# Altium project DEVEFX000001A.PrjPcb (part 1 of 2)
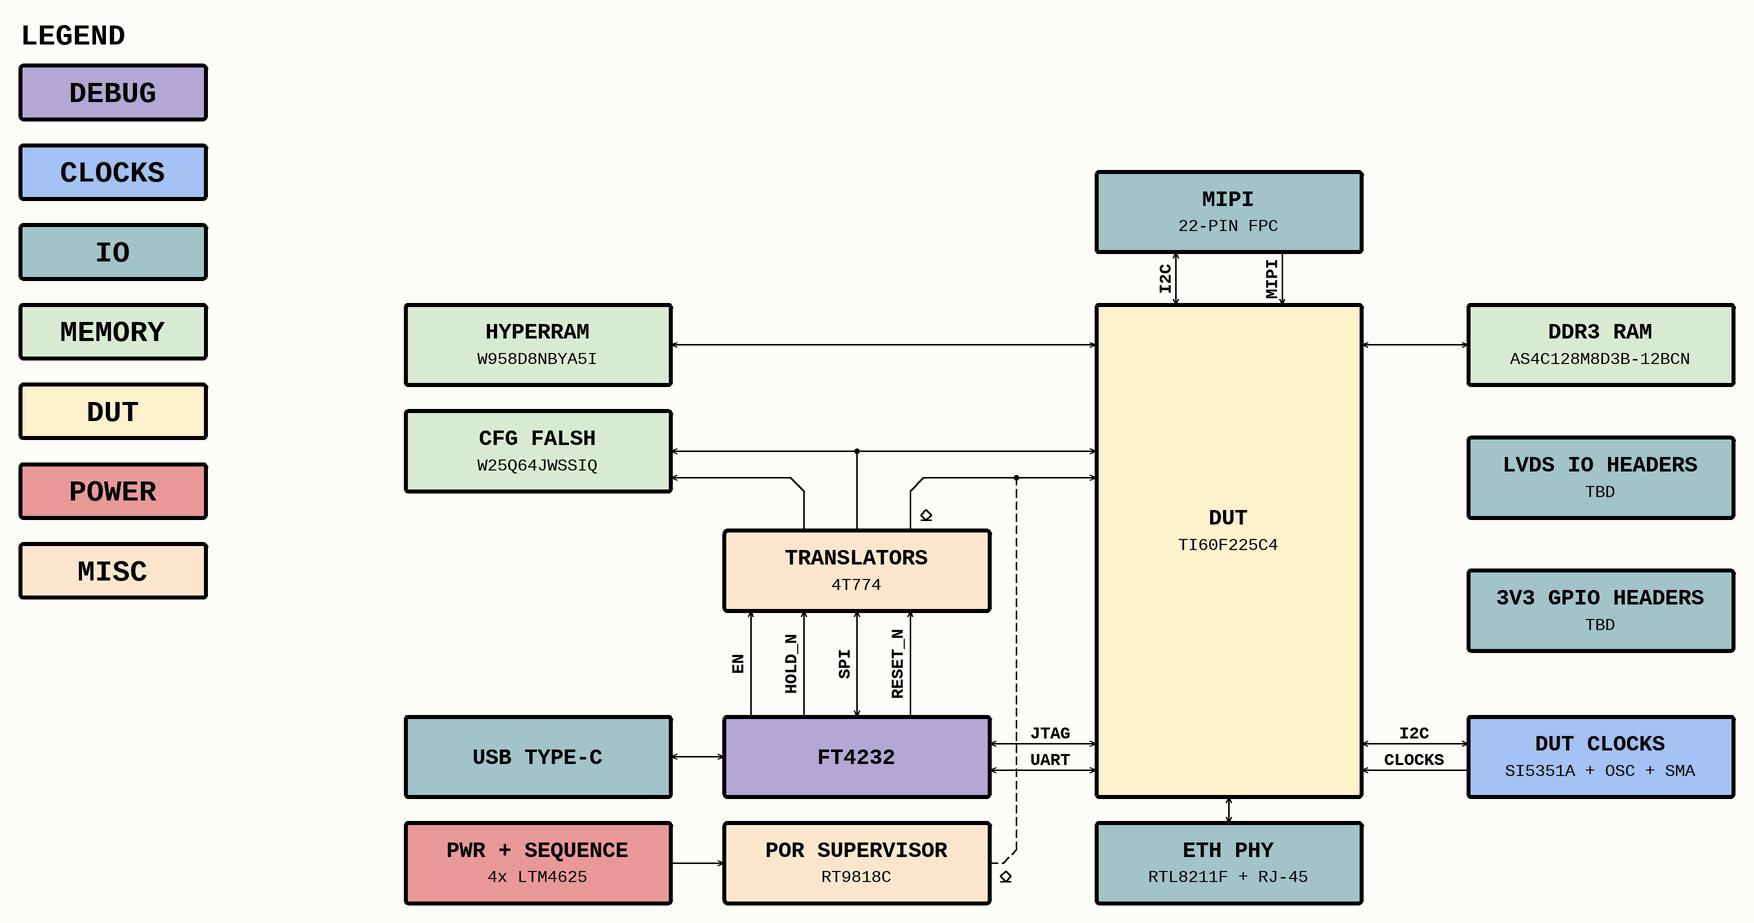
[diagram p0: 01_TOP.SchDoc]
21 sheets, 288 parts. Net scope: flat (ports and power ports of the same name join across sheets).
Board file: DEVEFX000001A.PcbDoc
Sheets:
  01_TOP.SchDoc
  02_RSVD.SchDoc
  03_RSVD.SchDoc
  04_RSVD.SchDoc
  05_FPGA_HVIO.SchDoc
  06_FPGA_HSIO_B1.SchDoc
  07_FPGA_HSIO_B2.SchDoc
  08_FPGA_HSIO_B3.SchDoc
  09_FPGA_HSIO_B4.SchDoc
  10_FPGA_PWR.SchDoc
  11_MEM_HYPERRAM_FLASH.SchDoc
  12_MEM_DDR3.SchDoc
  13_IO_ETH.SchDoc
  14_IO_MIPI.SchDoc
  15_IO_USB.SchDoc
  16_IO_LVDS.SchDoc
  17_IO_HEADERS.SchDoc
  18_PWR_INPUT.SchDoc
  19_PWR_VRS.SchDoc
  20_CLOCKS.SchDoc
  21_RESET_MISC.SchDoc

## Sheet 01_TOP.SchDoc
size A3; DocumentNumber: 1; SheetNumber: 1; SheetTotal: 21

### Notes on the sheet
- LEGEND
- DEBUG
- CLOCKS
- MIPI
- 22-PIN FPC
- IO
- I2C
- MEMORY
- HYPERRAM
- W958D8NBYA5I
- DDR3 RAM
- AS4C128M8D3B-12BCN
- DUT
- CFG FALSH
- POWER
- W25Q64JWSSIQ
- LVDS IO HEADERS
- TBD
- MISC
- TRANSLATORS
- TI60F225C4
- 4T774
- 3V3 GPIO HEADERS
- EN
- HOLD_N
- SPI
- RESET_N
- USB TYPE-C
- FT4232
- JTAG
- UART
- DUT CLOCKS
- SI5351A + OSC + SMA
- PWR + SEQUENCE
- 4x LTM4625
- POR SUPERVISOR
- RT9818C
- ETH PHY
- RTL8211F + RJ-45

## Sheet 02_RSVD.SchDoc
size A3; DocumentNumber: 2; SheetNumber: 2; SheetTotal: 21
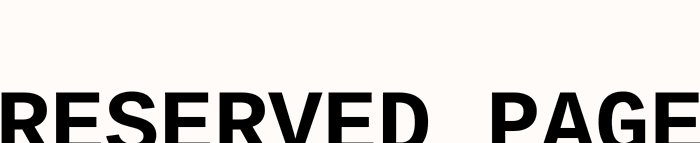
[diagram p1: 02_RSVD.SchDoc]

### Notes on the sheet
- RESERVED PAGE

## Sheet 03_RSVD.SchDoc
size A3; DocumentNumber: 3; SheetNumber: 3; SheetTotal: 21
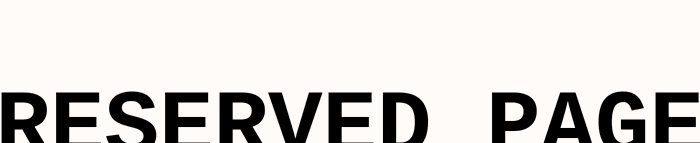
[diagram p2: 03_RSVD.SchDoc]

### Notes on the sheet
- RESERVED PAGE

## Sheet 04_RSVD.SchDoc
size A3; DocumentNumber: 4; SheetNumber: 4; SheetTotal: 21
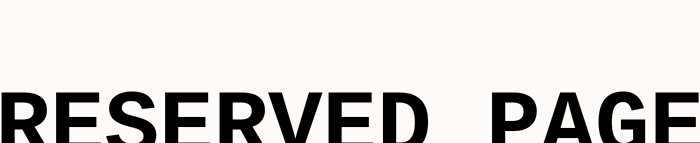
[diagram p3: 04_RSVD.SchDoc]

### Notes on the sheet
- RESERVED PAGE

## Sheet 05_FPGA_HVIO.SchDoc
size A3; DocumentNumber: 5; SheetNumber: 5; SheetTotal: 21
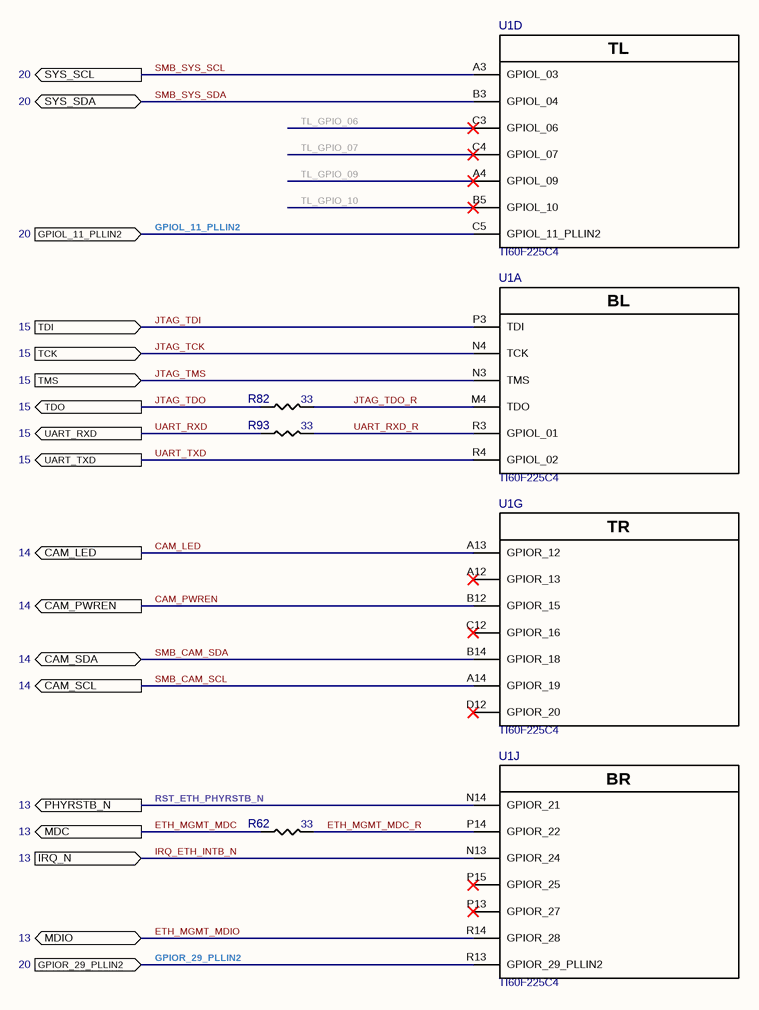
[diagram p4: 05_FPGA_HVIO.SchDoc]

### Parts
R62  33  [RESC1005X03N]
R82  33  [RESC1005X03N]
R93  33  [RESC1005X03N]
U1  TI60F225C4  [BGA225C65P15X15_1000X1000X100]  (parts A,D,G,J of 13)

### Ports
CAM_LED (out, see 14), CAM_PWREN (out, see 14), CAM_SCL (out, see 14), CAM_SDA (bidir, see 14), GPIOL_11_PLLIN2 (in, see 20), GPIOR_29_PLLIN2 (in, see 20), IRQ_N (in, see 13), MDC (out, see 13), MDIO (bidir, see 13), PHYRSTB_N (out, see 13), SYS_SCL (out, see 20), SYS_SDA (bidir, see 20), TCK (in, see 15), TDI (in, see 15), TDO (out, see 15), TMS (in, see 15), UART_RXD (out, see 15), UART_TXD (out, see 15)

### Nets
CAM_LED: U1.A13(GPIOR_12) ; port CAM_LED
CAM_PWREN: U1.B12(GPIOR_15) ; port CAM_PWREN
ETH_MGMT_MDC: R62.1 ; port MDC
ETH_MGMT_MDC_R: R62.2 U1.P14(GPIOR_22)
ETH_MGMT_MDIO: U1.R14(GPIOR_28) ; port MDIO
GPIOL_11_PLLIN2: U1.C5(GPIOL_11_PLLIN2) ; port GPIOL_11_PLLIN2
GPIOR_29_PLLIN2: U1.R13(GPIOR_29_PLLIN2) ; port GPIOR_29_PLLIN2
IRQ_ETH_INTB_N: U1.N13(GPIOR_24) ; port IRQ_N
JTAG_TCK: U1.N4(TCK) ; port TCK
JTAG_TDI: U1.P3(TDI) ; port TDI
JTAG_TDO: R82.1 ; port TDO
JTAG_TDO_R: R82.2 U1.M4(TDO)
JTAG_TMS: U1.N3(TMS) ; port TMS
RST_ETH_PHYRSTB_N: U1.N14(GPIOR_21) ; port PHYRSTB_N
SMB_CAM_SCL: U1.A14(GPIOR_19) ; port CAM_SCL
SMB_CAM_SDA: U1.B14(GPIOR_18) ; port CAM_SDA
SMB_SYS_SCL: U1.A3(GPIOL_03) ; port SYS_SCL
SMB_SYS_SDA: U1.B3(GPIOL_04) ; port SYS_SDA
TL_GPIO_06: U1.C3(GPIOL_06)
TL_GPIO_07: U1.C4(GPIOL_07)
TL_GPIO_09: U1.A4(GPIOL_09)
TL_GPIO_10: U1.B5(GPIOL_10)
UART_RXD: R93.1 ; port UART_RXD
UART_RXD_R: R93.2 U1.R3(GPIOL_01)
UART_TXD: U1.R4(GPIOL_02) ; port UART_TXD

Not connected (* = marked no-connect by the designer): U1 A12(GPIOR_13)* C12(GPIOR_16)* D12(GPIOR_20)* P13(GPIOR_27)* P15(GPIOR_25)*

### Notes on the sheet
- (in symbol TI60F225C4, part A) BL
- (in symbol TI60F225C4, part D) TL
- (in symbol TI60F225C4, part G) TR
- (in symbol TI60F225C4, part J) BR

### Library data of the parts
R62 R82 R93 = RC0402FR-0733RL: RES SMD 33 OHM 1% 1/16W 0402; Manufacturer 1: Yageo; Part Number: RC0402FR-0733RL; Value: 33; Tol: 1%; Manufacturer Part Number 1: RC0402FR-0733RL; Supplier 1: Digi-Key; Supplier Part Number 1: 311-33.0LRCT-ND
U1 = TI60F225C4: FPGA TITAN 140HSIO 4PLL 225BGA; Manufacturer 1: Efinix, Inc.; Part Number: TI60F225C4; Manufacturer Part Number 1: TI60F225C4; Supplier 1: Digi-Key; Supplier Part Number 1: 2134-TI60F225C4-ND

## Sheet 06_FPGA_HSIO_B1.SchDoc
size A3; DocumentNumber: 6; SheetNumber: 6; SheetTotal: 21
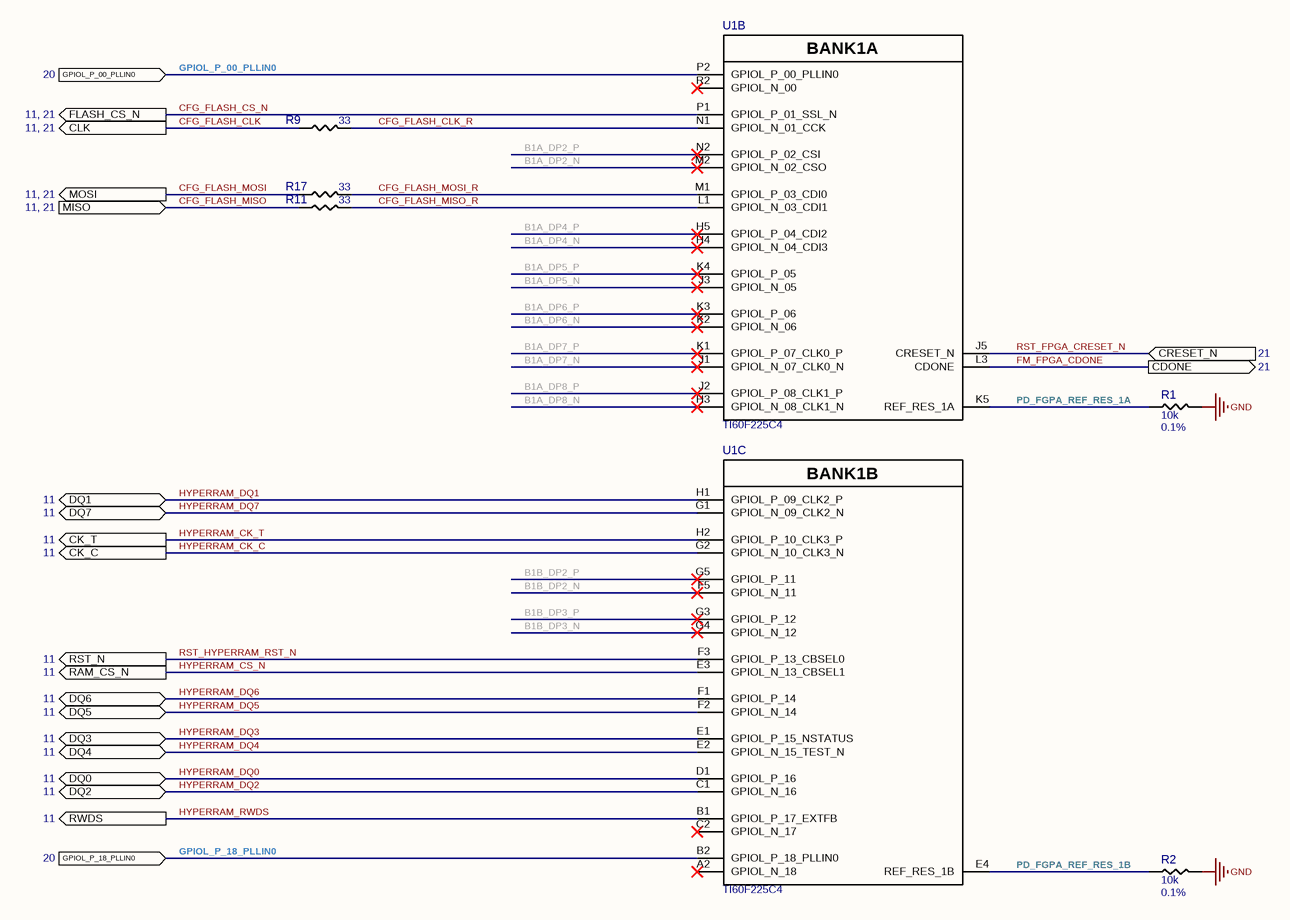
[diagram p5: 06_FPGA_HSIO_B1.SchDoc]

### Parts
R1  10k  Tol: 0.1%  [RESC1005X03N]
R2  10k  Tol: 0.1%  [RESC1005X03N]
R9  33  [RESC1005X03N]
R11  33  [RESC1005X03N]
R17  33  [RESC1005X03N]
U1  TI60F225C4  [BGA225C65P15X15_1000X1000X100]  (parts B,C of 13)

### Ports
CDONE (out, see 21), CK_C (out, see 11), CK_T (out, see 11), CLK (out, see 11, 21), CRESET_N (in, see 21), DQ0 (bidir, see 11), DQ1 (bidir, see 11), DQ2 (bidir, see 11), DQ3 (bidir, see 11), DQ4 (bidir, see 11), DQ5 (bidir, see 11), DQ6 (bidir, see 11), DQ7 (bidir, see 11), FLASH_CS_N (out, see 11, 21), GPIOL_P_00_PLLIN0 (in, see 20), GPIOL_P_18_PLLIN0 (in, see 20), MISO (in, see 11, 21), MOSI (out, see 11, 21), RAM_CS_N (out, see 11), RST_N (out, see 11), RWDS (out, see 11)

### Nets
GND: R1.2 R2.2
B1A_DP2_N: U1.M2(GPIOL_N_02_CSO)
B1A_DP2_P: U1.N2(GPIOL_P_02_CSI)
B1A_DP4_N: U1.H4(GPIOL_N_04_CDI3)
B1A_DP4_P: U1.H5(GPIOL_P_04_CDI2)
B1A_DP5_N: U1.J3(GPIOL_N_05)
B1A_DP5_P: U1.K4(GPIOL_P_05)
B1A_DP6_N: U1.K2(GPIOL_N_06)
B1A_DP6_P: U1.K3(GPIOL_P_06)
B1A_DP7_N: U1.J1(GPIOL_N_07_CLK0_N)
B1A_DP7_P: U1.K1(GPIOL_P_07_CLK0_P)
B1A_DP8_N: U1.H3(GPIOL_N_08_CLK1_N)
B1A_DP8_P: U1.J2(GPIOL_P_08_CLK1_P)
B1B_DP2_N: U1.F5(GPIOL_N_11)
B1B_DP2_P: U1.G5(GPIOL_P_11)
B1B_DP3_N: U1.G4(GPIOL_N_12)
B1B_DP3_P: U1.G3(GPIOL_P_12)
CFG_FLASH_CLK: R9.1 ; port CLK
CFG_FLASH_CLK_R: R9.2 U1.N1(GPIOL_N_01_CCK)
CFG_FLASH_CS_N: U1.P1(GPIOL_P_01_SSL_N) ; port FLASH_CS_N
CFG_FLASH_MISO: R11.1 ; port MISO
CFG_FLASH_MISO_R: R11.2 U1.L1(GPIOL_N_03_CDI1)
CFG_FLASH_MOSI: R17.1 ; port MOSI
CFG_FLASH_MOSI_R: R17.2 U1.M1(GPIOL_P_03_CDI0)
FM_FPGA_CDONE: U1.L3(CDONE) ; port CDONE
GPIOL_P_00_PLLIN0: U1.P2(GPIOL_P_00_PLLIN0) ; port GPIOL_P_00_PLLIN0
GPIOL_P_18_PLLIN0: U1.B2(GPIOL_P_18_PLLIN0) ; port GPIOL_P_18_PLLIN0
HYPERRAM_CK_C: U1.G2(GPIOL_N_10_CLK3_N) ; port CK_C
HYPERRAM_CK_T: U1.H2(GPIOL_P_10_CLK3_P) ; port CK_T
HYPERRAM_CS_N: U1.E3(GPIOL_N_13_CBSEL1) ; port RAM_CS_N
HYPERRAM_DQ0: U1.D1(GPIOL_P_16) ; port DQ0
HYPERRAM_DQ1: U1.H1(GPIOL_P_09_CLK2_P) ; port DQ1
HYPERRAM_DQ2: U1.C1(GPIOL_N_16) ; port DQ2
HYPERRAM_DQ3: U1.E1(GPIOL_P_15_NSTATUS) ; port DQ3
HYPERRAM_DQ4: U1.E2(GPIOL_N_15_TEST_N) ; port DQ4
HYPERRAM_DQ5: U1.F2(GPIOL_N_14) ; port DQ5
HYPERRAM_DQ6: U1.F1(GPIOL_P_14) ; port DQ6
HYPERRAM_DQ7: U1.G1(GPIOL_N_09_CLK2_N) ; port DQ7
HYPERRAM_RWDS: U1.B1(GPIOL_P_17_EXTFB) ; port RWDS
PD_FGPA_REF_RES_1A: R1.1 U1.K5(REF_RES_1A)
PD_FGPA_REF_RES_1B: R2.1 U1.E4(REF_RES_1B)
RST_FPGA_CRESET_N: U1.J5(CRESET_N) ; port CRESET_N
RST_HYPERRAM_RST_N: U1.F3(GPIOL_P_13_CBSEL0) ; port RST_N

Not connected (* = marked no-connect by the designer): U1 A2(GPIOL_N_18)* C2(GPIOL_N_17)* R2(GPIOL_N_00)*

### Notes on the sheet
- (in symbol TI60F225C4, part B) BANK1A
- (in symbol TI60F225C4, part C) BANK1B

### Library data of the parts
R1 R2 = RT0402BRD0710KL: RES SMD 10K OHM 0.1% 1/16W 0402; Manufacturer 1: Yageo; Part Number: RT0402BRD0710KL; Value: 10k; Manufacturer Part Number 1: RT0402BRD0710KL; Supplier 1: Digi-Key; Supplier Part Number 1: YAG1346CT-ND
R9 R11 R17 = RC0402FR-0733RL: as R62 on sheet 05_FPGA_HVIO; Part Number: RC0402FR-0733RL; Value: 33; Tol: 1%; Manufacturer Part Number 1: RC0402FR-0733RL; Supplier 1: Digi-Key; Supplier Part Number 1: 311-33.0LRCT-ND
U1 = TI60F225C4: as U1 on sheet 05_FPGA_HVIO; Part Number: TI60F225C4; Manufacturer Part Number 1: TI60F225C4; Supplier 1: Digi-Key; Supplier Part Number 1: 2134-TI60F225C4-ND

## Sheet 07_FPGA_HSIO_B2.SchDoc
size A3; DocumentNumber: 7; SheetNumber: 7; SheetTotal: 21
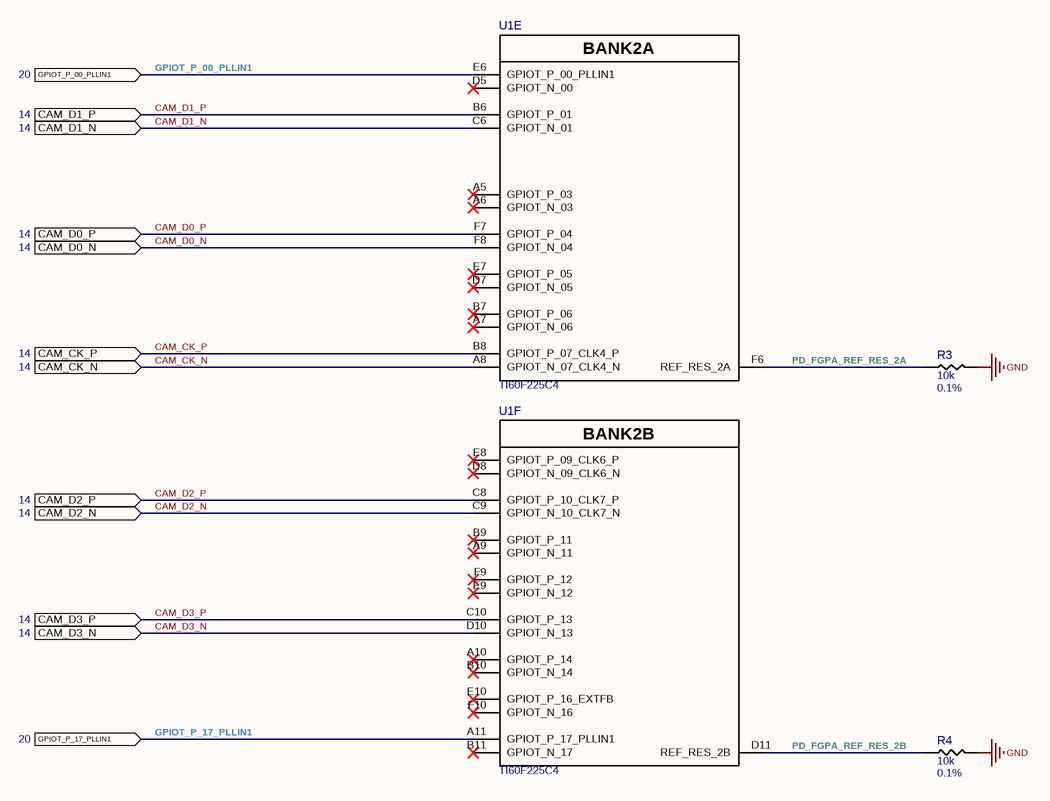
[diagram p6: 07_FPGA_HSIO_B2.SchDoc]

### Parts
R3  10k  Tol: 0.1%  [RESC1005X03N]
R4  10k  Tol: 0.1%  [RESC1005X03N]
U1  TI60F225C4  [BGA225C65P15X15_1000X1000X100]  (parts E,F of 13)

### Ports
CAM_CK_N (in, see 14), CAM_CK_P (in, see 14), CAM_D0_N (in, see 14), CAM_D0_P (in, see 14), CAM_D1_N (in, see 14), CAM_D1_P (in, see 14), CAM_D2_N (in, see 14), CAM_D2_P (in, see 14), CAM_D3_N (in, see 14), CAM_D3_P (in, see 14), GPIOT_P_00_PLLIN1 (in, see 20), GPIOT_P_17_PLLIN1 (in, see 20)

### Nets
GND: R3.2 R4.2
CAM_CK_N: U1.A8(GPIOT_N_07_CLK4_N) ; port CAM_CK_N
CAM_CK_P: U1.B8(GPIOT_P_07_CLK4_P) ; port CAM_CK_P
CAM_D0_N: U1.F8(GPIOT_N_04) ; port CAM_D0_N
CAM_D0_P: U1.F7(GPIOT_P_04) ; port CAM_D0_P
CAM_D1_N: U1.C6(GPIOT_N_01) ; port CAM_D1_N
CAM_D1_P: U1.B6(GPIOT_P_01) ; port CAM_D1_P
CAM_D2_N: U1.C9(GPIOT_N_10_CLK7_N) ; port CAM_D2_N
CAM_D2_P: U1.C8(GPIOT_P_10_CLK7_P) ; port CAM_D2_P
CAM_D3_N: U1.D10(GPIOT_N_13) ; port CAM_D3_N
CAM_D3_P: U1.C10(GPIOT_P_13) ; port CAM_D3_P
GPIOT_P_00_PLLIN1: U1.E6(GPIOT_P_00_PLLIN1) ; port GPIOT_P_00_PLLIN1
GPIOT_P_17_PLLIN1: U1.A11(GPIOT_P_17_PLLIN1) ; port GPIOT_P_17_PLLIN1
PD_FGPA_REF_RES_2A: R3.1 U1.F6(REF_RES_2A)
PD_FGPA_REF_RES_2B: R4.1 U1.D11(REF_RES_2B)

Not connected (* = marked no-connect by the designer): U1 A5(GPIOT_P_03)* A6(GPIOT_N_03)* A7(GPIOT_N_06)* A9(GPIOT_N_11)* A10(GPIOT_P_14)* B7(GPIOT_P_06)* B9(GPIOT_P_11)* B10(GPIOT_N_14)* B11(GPIOT_N_17)* D5(GPIOT_N_00)* D7(GPIOT_N_05)* D8(GPIOT_N_09_CLK6_N)* E7(GPIOT_P_05)* E8(GPIOT_P_09_CLK6_P)* E9(GPIOT_N_12)* E10(GPIOT_P_16_EXTFB)* F9(GPIOT_P_12)* F10(GPIOT_N_16)*

### Notes on the sheet
- (in symbol TI60F225C4, part E) BANK2A
- (in symbol TI60F225C4, part F) BANK2B

### Library data of the parts
R3 R4 = RT0402BRD0710KL: as R1 on sheet 06_FPGA_HSIO_B1; Part Number: RT0402BRD0710KL; Value: 10k; Manufacturer Part Number 1: RT0402BRD0710KL; Supplier 1: Digi-Key; Supplier Part Number 1: YAG1346CT-ND
U1 = TI60F225C4: as U1 on sheet 05_FPGA_HVIO; Part Number: TI60F225C4; Manufacturer Part Number 1: TI60F225C4; Supplier 1: Digi-Key; Supplier Part Number 1: 2134-TI60F225C4-ND

## Sheet 08_FPGA_HSIO_B3.SchDoc
size A3; DocumentNumber: 8; SheetNumber: 8; SheetTotal: 21
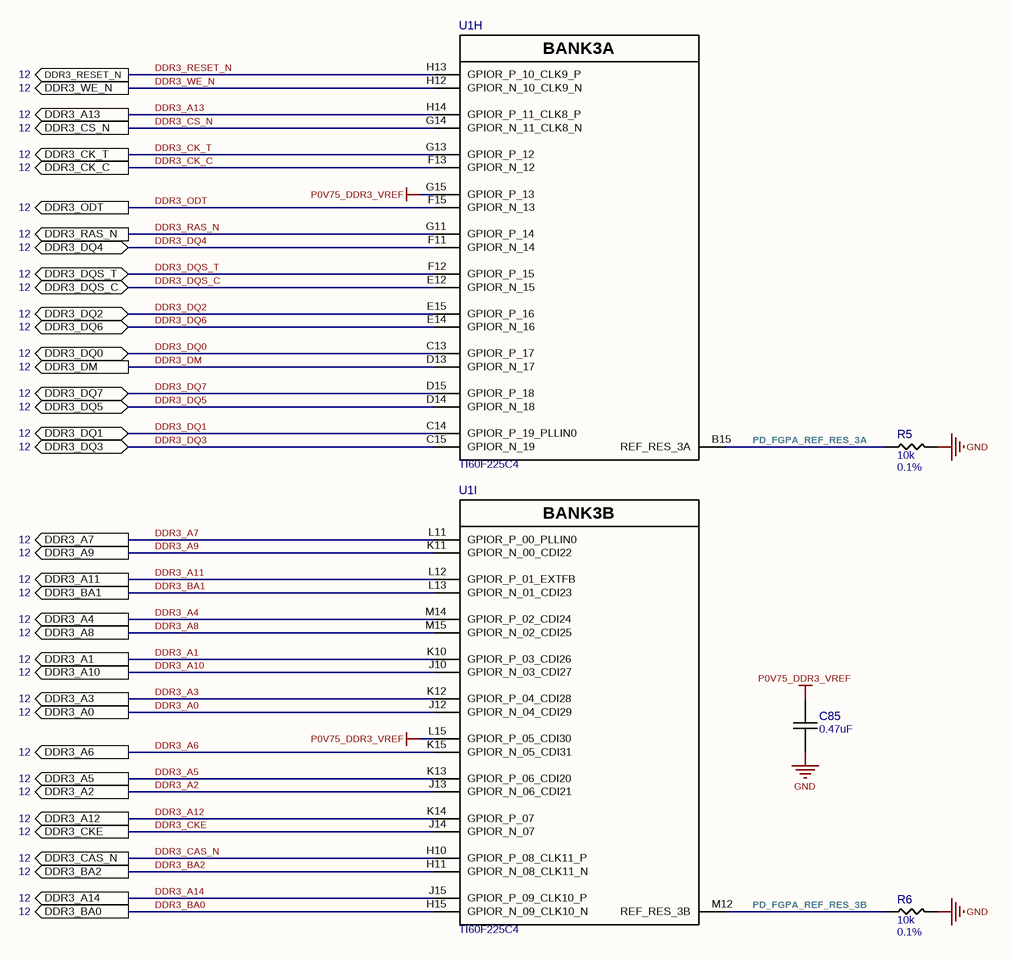
[diagram p7: 08_FPGA_HSIO_B3.SchDoc]

### Parts
C85  0.47uF  [CAPC0603X03N]
R5  10k  Tol: 0.1%  [RESC1005X03N]
R6  10k  Tol: 0.1%  [RESC1005X03N]
U1  TI60F225C4  [BGA225C65P15X15_1000X1000X100]  (parts H,I of 13)

### Ports
DDR3_A0 (out, see 12), DDR3_A1 (out, see 12), DDR3_A2 (out, see 12), DDR3_A3 (out, see 12), DDR3_A4 (out, see 12), DDR3_A5 (out, see 12), DDR3_A6 (out, see 12), DDR3_A7 (out, see 12), DDR3_A8 (out, see 12), DDR3_A9 (out, see 12), DDR3_A10 (out, see 12), DDR3_A11 (out, see 12), DDR3_A12 (out, see 12), DDR3_A13 (out, see 12), DDR3_A14 (out, see 12), DDR3_BA0 (out, see 12), DDR3_BA1 (out, see 12), DDR3_BA2 (out, see 12), DDR3_CAS_N (out, see 12), DDR3_CK_C (out, see 12), DDR3_CK_T (out, see 12), DDR3_CKE (out, see 12), DDR3_CS_N (out, see 12), DDR3_DM (out, see 12), DDR3_DQ0 (bidir, see 12), DDR3_DQ1 (bidir, see 12), DDR3_DQ2 (bidir, see 12), DDR3_DQ3 (bidir, see 12), DDR3_DQ4 (bidir, see 12), DDR3_DQ5 (bidir, see 12), DDR3_DQ6 (bidir, see 12), DDR3_DQ7 (bidir, see 12), DDR3_DQS_C (bidir, see 12), DDR3_DQS_T (bidir, see 12), DDR3_ODT (out, see 12), DDR3_RAS_N (out, see 12), DDR3_RESET_N (out, see 12), DDR3_WE_N (out, see 12)

### Nets
GND: C85.1 R5.2 R6.2
P0V75_DDR3_VREF: C85.2 U1.G15(GPIOR_P_13) U1.L15(GPIOR_P_05_CDI30)
DDR3_A0: U1.J12(GPIOR_N_04_CDI29) ; port DDR3_A0
DDR3_A1: U1.K10(GPIOR_P_03_CDI26) ; port DDR3_A1
DDR3_A2: U1.J13(GPIOR_N_06_CDI21) ; port DDR3_A2
DDR3_A3: U1.K12(GPIOR_P_04_CDI28) ; port DDR3_A3
DDR3_A4: U1.M14(GPIOR_P_02_CDI24) ; port DDR3_A4
DDR3_A5: U1.K13(GPIOR_P_06_CDI20) ; port DDR3_A5
DDR3_A6: U1.K15(GPIOR_N_05_CDI31) ; port DDR3_A6
DDR3_A7: U1.L11(GPIOR_P_00_PLLIN0) ; port DDR3_A7
DDR3_A8: U1.M15(GPIOR_N_02_CDI25) ; port DDR3_A8
DDR3_A9: U1.K11(GPIOR_N_00_CDI22) ; port DDR3_A9
DDR3_A10: U1.J10(GPIOR_N_03_CDI27) ; port DDR3_A10
DDR3_A11: U1.L12(GPIOR_P_01_EXTFB) ; port DDR3_A11
DDR3_A12: U1.K14(GPIOR_P_07) ; port DDR3_A12
DDR3_A13: U1.H14(GPIOR_P_11_CLK8_P) ; port DDR3_A13
DDR3_A14: U1.J15(GPIOR_P_09_CLK10_P) ; port DDR3_A14
DDR3_BA0: U1.H15(GPIOR_N_09_CLK10_N) ; port DDR3_BA0
DDR3_BA1: U1.L13(GPIOR_N_01_CDI23) ; port DDR3_BA1
DDR3_BA2: U1.H11(GPIOR_N_08_CLK11_N) ; port DDR3_BA2
DDR3_CAS_N: U1.H10(GPIOR_P_08_CLK11_P) ; port DDR3_CAS_N
DDR3_CK_C: U1.F13(GPIOR_N_12) ; port DDR3_CK_C
DDR3_CK_T: U1.G13(GPIOR_P_12) ; port DDR3_CK_T
DDR3_CKE: U1.J14(GPIOR_N_07) ; port DDR3_CKE
DDR3_CS_N: U1.G14(GPIOR_N_11_CLK8_N) ; port DDR3_CS_N
DDR3_DM: U1.D13(GPIOR_N_17) ; port DDR3_DM
DDR3_DQ0: U1.C13(GPIOR_P_17) ; port DDR3_DQ0
DDR3_DQ1: U1.C14(GPIOR_P_19_PLLIN0) ; port DDR3_DQ1
DDR3_DQ2: U1.E15(GPIOR_P_16) ; port DDR3_DQ2
DDR3_DQ3: U1.C15(GPIOR_N_19) ; port DDR3_DQ3
DDR3_DQ4: U1.F11(GPIOR_N_14) ; port DDR3_DQ4
DDR3_DQ5: U1.D14(GPIOR_N_18) ; port DDR3_DQ5
DDR3_DQ6: U1.E14(GPIOR_N_16) ; port DDR3_DQ6
DDR3_DQ7: U1.D15(GPIOR_P_18) ; port DDR3_DQ7
DDR3_DQS_C: U1.E12(GPIOR_N_15) ; port DDR3_DQS_C
DDR3_DQS_T: U1.F12(GPIOR_P_15) ; port DDR3_DQS_T
DDR3_ODT: U1.F15(GPIOR_N_13) ; port DDR3_ODT
DDR3_RAS_N: U1.G11(GPIOR_P_14) ; port DDR3_RAS_N
DDR3_RESET_N: U1.H13(GPIOR_P_10_CLK9_P) ; port DDR3_RESET_N
DDR3_WE_N: U1.H12(GPIOR_N_10_CLK9_N) ; port DDR3_WE_N
PD_FGPA_REF_RES_3A: R5.1 U1.B15(REF_RES_3A)
PD_FGPA_REF_RES_3B: R6.1 U1.M12(REF_RES_3B)

### Notes on the sheet
- (in symbol TI60F225C4, part H) BANK3A
- (in symbol TI60F225C4, part I) BANK3B

### Library data of the parts
C85 = GRM033R60J474KE90D: CAP CER 0.47UF 6.3V X5R 0201; Manufacturer 1: Murata Electronics; Tol: 10%; Part Number: GRM033R60J474KE90D; Value: 0.47uF; Voltage: 6.3V; TempC: X5R; Manufacturer Part Number 1: GRM033R60J474KE90D; Supplier 1: Digi-Key; Supplier Part Number 1: 490-10409-1-ND
R5 R6 = RT0402BRD0710KL: as R1 on sheet 06_FPGA_HSIO_B1; Part Number: RT0402BRD0710KL; Value: 10k; Manufacturer Part Number 1: RT0402BRD0710KL; Supplier 1: Digi-Key; Supplier Part Number 1: YAG1346CT-ND
U1 = TI60F225C4: as U1 on sheet 05_FPGA_HVIO; Part Number: TI60F225C4; Manufacturer Part Number 1: TI60F225C4; Supplier 1: Digi-Key; Supplier Part Number 1: 2134-TI60F225C4-ND

## Sheet 09_FPGA_HSIO_B4.SchDoc
size A3; DocumentNumber: 9; SheetNumber: 9; SheetTotal: 21
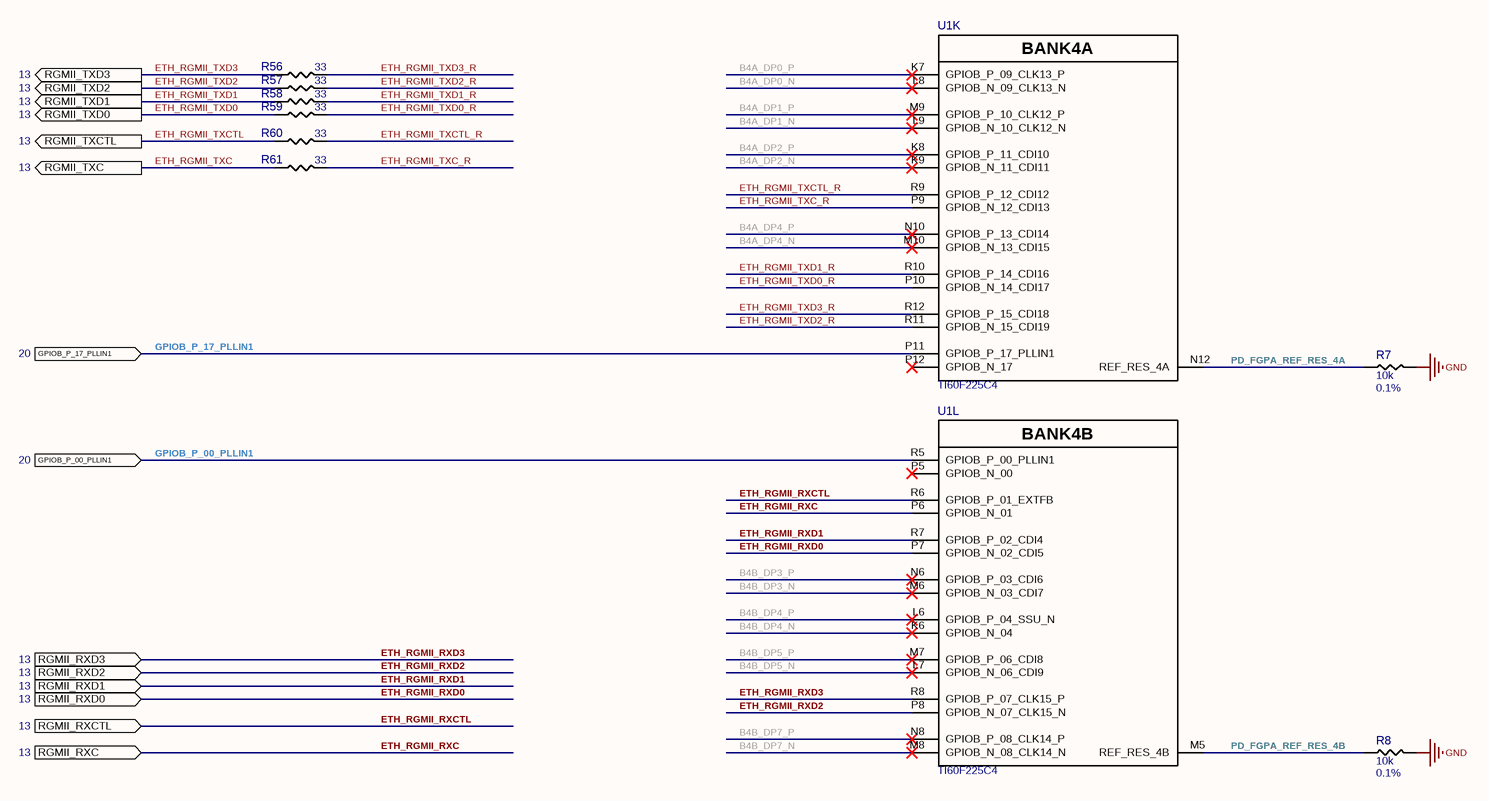
[diagram p8: 09_FPGA_HSIO_B4.SchDoc]

### Parts
R7  10k  Tol: 0.1%  [RESC1005X03N]
R8  10k  Tol: 0.1%  [RESC1005X03N]
R56  33  [RESC1005X03N]
R57  33  [RESC1005X03N]
R58  33  [RESC1005X03N]
R59  33  [RESC1005X03N]
R60  33  [RESC1005X03N]
R61  33  [RESC1005X03N]
U1  TI60F225C4  [BGA225C65P15X15_1000X1000X100]  (parts K,L of 13)

### Ports
GPIOB_P_00_PLLIN1 (in, see 20), GPIOB_P_17_PLLIN1 (in, see 20), RGMII_RXC (in, see 13), RGMII_RXCTL (in, see 13), RGMII_RXD0 (in, see 13), RGMII_RXD1 (in, see 13), RGMII_RXD2 (in, see 13), RGMII_RXD3 (in, see 13), RGMII_TXC (out, see 13), RGMII_TXCTL (out, see 13), RGMII_TXD0 (out, see 13), RGMII_TXD1 (out, see 13), RGMII_TXD2 (out, see 13), RGMII_TXD3 (out, see 13)

### Nets
GND: R7.2 R8.2
B4A_DP0_N: U1.L8(GPIOB_N_09_CLK13_N)
B4A_DP0_P: U1.K7(GPIOB_P_09_CLK13_P)
B4A_DP1_N: U1.L9(GPIOB_N_10_CLK12_N)
B4A_DP1_P: U1.M9(GPIOB_P_10_CLK12_P)
B4A_DP2_N: U1.K9(GPIOB_N_11_CDI11)
B4A_DP2_P: U1.K8(GPIOB_P_11_CDI10)
B4A_DP4_N: U1.M10(GPIOB_N_13_CDI15)
B4A_DP4_P: U1.N10(GPIOB_P_13_CDI14)
B4B_DP3_N: U1.M6(GPIOB_N_03_CDI7)
B4B_DP3_P: U1.N6(GPIOB_P_03_CDI6)
B4B_DP4_N: U1.K6(GPIOB_N_04)
B4B_DP4_P: U1.L6(GPIOB_P_04_SSU_N)
B4B_DP5_N: U1.L7(GPIOB_N_06_CDI9)
B4B_DP5_P: U1.M7(GPIOB_P_06_CDI8)
B4B_DP7_N: U1.M8(GPIOB_N_08_CLK14_N)
B4B_DP7_P: U1.N8(GPIOB_P_08_CLK14_P)
ETH_RGMII_RXC: U1.P6(GPIOB_N_01) ; port RGMII_RXC
ETH_RGMII_RXCTL: U1.R6(GPIOB_P_01_EXTFB) ; port RGMII_RXCTL
ETH_RGMII_RXD0: U1.P7(GPIOB_N_02_CDI5) ; port RGMII_RXD0
ETH_RGMII_RXD1: U1.R7(GPIOB_P_02_CDI4) ; port RGMII_RXD1
ETH_RGMII_RXD2: U1.P8(GPIOB_N_07_CLK15_N) ; port RGMII_RXD2
ETH_RGMII_RXD3: U1.R8(GPIOB_P_07_CLK15_P) ; port RGMII_RXD3
ETH_RGMII_TXC: R61.1 ; port RGMII_TXC
ETH_RGMII_TXC_R: R61.2 U1.P9(GPIOB_N_12_CDI13)
ETH_RGMII_TXCTL: R60.1 ; port RGMII_TXCTL
ETH_RGMII_TXCTL_R: R60.2 U1.R9(GPIOB_P_12_CDI12)
ETH_RGMII_TXD0: R59.1 ; port RGMII_TXD0
ETH_RGMII_TXD0_R: R59.2 U1.P10(GPIOB_N_14_CDI17)
ETH_RGMII_TXD1: R58.1 ; port RGMII_TXD1
ETH_RGMII_TXD1_R: R58.2 U1.R10(GPIOB_P_14_CDI16)
ETH_RGMII_TXD2: R57.1 ; port RGMII_TXD2
ETH_RGMII_TXD2_R: R57.2 U1.R11(GPIOB_N_15_CDI19)
ETH_RGMII_TXD3: R56.1 ; port RGMII_TXD3
ETH_RGMII_TXD3_R: R56.2 U1.R12(GPIOB_P_15_CDI18)
GPIOB_P_00_PLLIN1: U1.R5(GPIOB_P_00_PLLIN1) ; port GPIOB_P_00_PLLIN1
GPIOB_P_17_PLLIN1: U1.P11(GPIOB_P_17_PLLIN1) ; port GPIOB_P_17_PLLIN1
PD_FGPA_REF_RES_4A: R7.1 U1.N12(REF_RES_4A)
PD_FGPA_REF_RES_4B: R8.1 U1.M5(REF_RES_4B)

Not connected (* = marked no-connect by the designer): U1 P5(GPIOB_N_00)* P12(GPIOB_N_17)*

### Notes on the sheet
- (in symbol TI60F225C4, part K) BANK4A
- (in symbol TI60F225C4, part L) BANK4B

### Library data of the parts
R7 R8 = RT0402BRD0710KL: as R1 on sheet 06_FPGA_HSIO_B1; Part Number: RT0402BRD0710KL; Value: 10k; Manufacturer Part Number 1: RT0402BRD0710KL; Supplier 1: Digi-Key; Supplier Part Number 1: YAG1346CT-ND
R56-R61 = RC0402FR-0733RL: as R62 on sheet 05_FPGA_HVIO; Part Number: RC0402FR-0733RL; Value: 33; Tol: 1%; Manufacturer Part Number 1: RC0402FR-0733RL; Supplier 1: Digi-Key; Supplier Part Number 1: 311-33.0LRCT-ND
U1 = TI60F225C4: as U1 on sheet 05_FPGA_HVIO; Part Number: TI60F225C4; Manufacturer Part Number 1: TI60F225C4; Supplier 1: Digi-Key; Supplier Part Number 1: 2134-TI60F225C4-ND

## Sheet 10_FPGA_PWR.SchDoc
size A3; DocumentNumber: 10; SheetNumber: 10; SheetTotal: 21
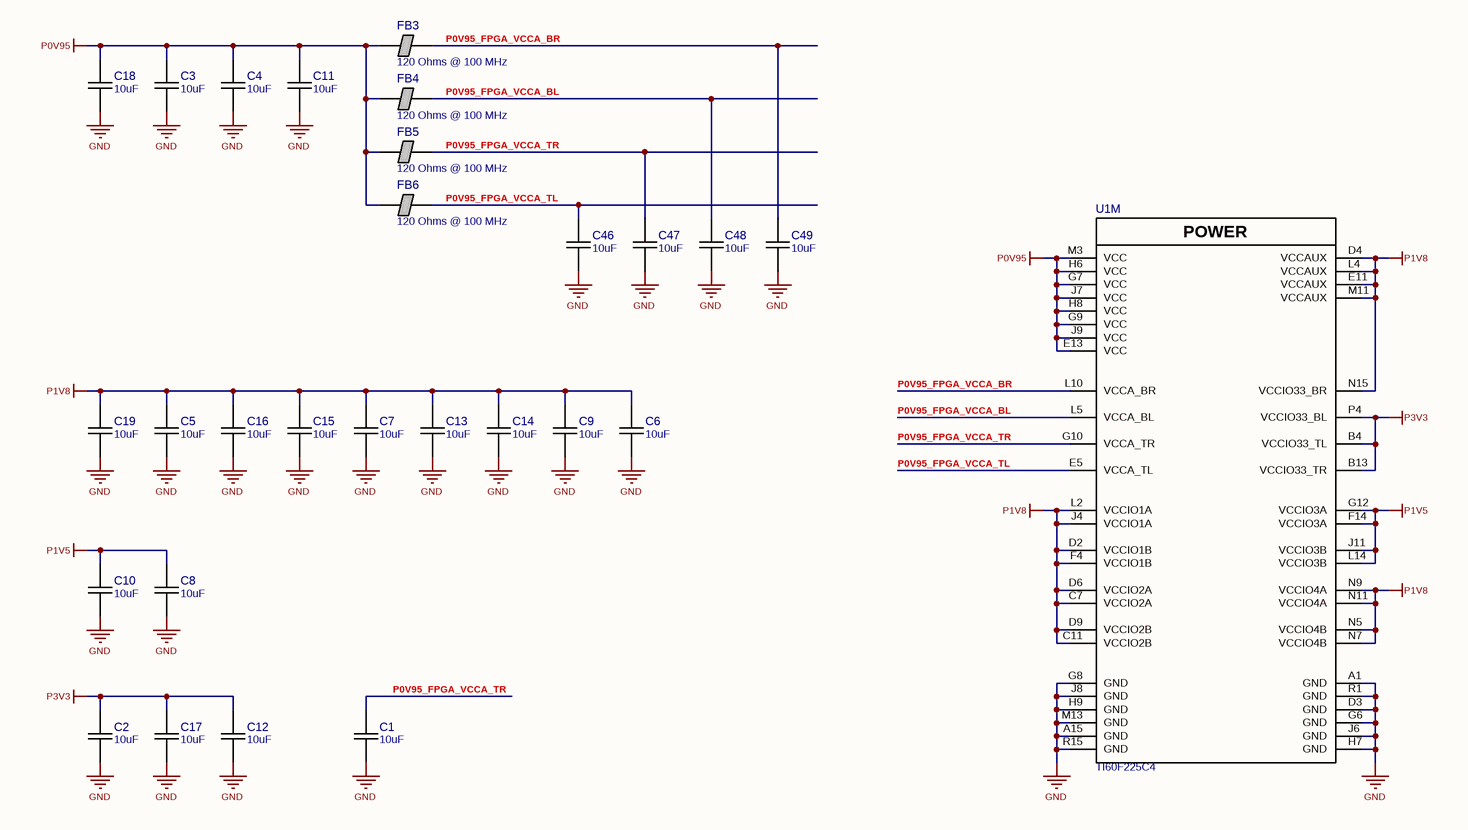
[diagram p9: 10_FPGA_PWR.SchDoc]

### Parts
C1  10uF  [CAPC1005X06N]
C2  10uF  [CAPC1005X06N]
C3  10uF  [CAPC1005X06N]
C4  10uF  [CAPC1005X06N]
C5  10uF  [CAPC1005X06N]
C6  10uF  [CAPC1005X06N]
C7  10uF  [CAPC1005X06N]
C8  10uF  [CAPC1005X06N]
C9  10uF  [CAPC1005X06N]
C10  10uF  [CAPC1005X06N]
C11  10uF  [CAPC1005X06N]
C12  10uF  [CAPC1005X06N]
C13  10uF  [CAPC1005X06N]
C14  10uF  [CAPC1005X06N]
C15  10uF  [CAPC1005X06N]
C16  10uF  [CAPC1005X06N]
C17  10uF  [CAPC1005X06N]
C18  10uF  [CAPC1005X06N]
C19  10uF  [CAPC1005X06N]
C46  10uF  [CAPC1005X06N]
C47  10uF  [CAPC1005X06N]
C48  10uF  [CAPC1005X06N]
C49  10uF  [CAPC1005X06N]
FB3  120 Ohms @ 100 MHz  [INDC1005X05N]
FB4  120 Ohms @ 100 MHz  [INDC1005X05N]
FB5  120 Ohms @ 100 MHz  [INDC1005X05N]
FB6  120 Ohms @ 100 MHz  [INDC1005X05N]
U1  TI60F225C4  [BGA225C65P15X15_1000X1000X100]  (part M of 13)

### Nets
GND: C1.1 C2.1 C3.1 C4.1 C5.1 C6.1 C7.1 C8.1 C9.1 C10.1 C11.1 C12.1 C13.1 C14.1 C15.1 C16.1 C17.1 C18.1 C19.1 C46.1 C47.1 C48.1 C49.1 U1.A1(GND) U1.A15(GND) U1.D3(GND) U1.G6(GND) U1.G8(GND) U1.H7(GND) U1.H9(GND) U1.J6(GND) U1.J8(GND) U1.M13(GND) U1.R1(GND) U1.R15(GND)
P0V95: C3.2 C4.2 C11.2 C18.2 FB3.1 FB4.1 FB5.1 FB6.1 U1.E13(VCC) U1.G7(VCC) U1.G9(VCC) U1.H6(VCC) U1.H8(VCC) U1.J7(VCC) U1.J9(VCC) U1.M3(VCC)
P1V5: C8.2 C10.2 U1.F14(VCCIO3A) U1.G12(VCCIO3A) U1.J11(VCCIO3B) U1.L14(VCCIO3B)
P1V8: C5.2 C6.2 C7.2 C9.2 C13.2 C14.2 C15.2 C16.2 C19.2 U1.C7(VCCIO2A) U1.C11(VCCIO2B) U1.D2(VCCIO1B) U1.D4(VCCAUX) U1.D6(VCCIO2A) U1.D9(VCCIO2B) U1.E11(VCCAUX) U1.F4(VCCIO1B) U1.J4(VCCIO1A) U1.L2(VCCIO1A) U1.L4(VCCAUX) U1.M11(VCCAUX) U1.N5(VCCIO4B) U1.N7(VCCIO4B) U1.N9(VCCIO4A) U1.N11(VCCIO4A) U1.N15(VCCIO33_BR)
P3V3: C2.2 C12.2 C17.2 U1.B4(VCCIO33_TL) U1.B13(VCCIO33_TR) U1.P4(VCCIO33_BL)
P0V95_FPGA_VCCA_BL: C48.2 FB4.2 U1.L5(VCCA_BL)
P0V95_FPGA_VCCA_BR: C49.2 FB3.2 U1.L10(VCCA_BR)
P0V95_FPGA_VCCA_TL: C46.2 FB6.2 U1.E5(VCCA_TL)
P0V95_FPGA_VCCA_TR: C1.2 C47.2 FB5.2 U1.G10(VCCA_TR)

### Notes on the sheet
- (in symbol TI60F225C4, part M) POWER

### Library data of the parts
C1-C19 C46-C49 = GRM155R60J106ME47D: CAP CER 10UF 6.3V X5R 0402; Manufacturer 1: Murata Electronics; Tol: 20%; Part Number: GRM155R60J106ME47D; Value: 10uF; Voltage: 6.3V; TempC: X5R; Manufacturer Part Number 1: GRM155R60J106ME47D; Supplier 1: Digi-Key; Supplier Part Number 1: 490-13239-1-ND
FB3-FB6 = BLM15PD121SN1D: FERRITE BEAD 120 OHM 0402 1LN; Manufacturer 1: Murata Electronics; DCR: 90mOhm; Ir: 1.3A; Part Number: BLM15PD121SN1D; Value: 120 Ohms @ 100 MHz; Manufacturer Part Number 1: BLM15PD121SN1D; Supplier 1: Digi-Key; Supplier Part Number 1: 490-5203-1-ND
U1 = TI60F225C4: as U1 on sheet 05_FPGA_HVIO; Part Number: TI60F225C4; Manufacturer Part Number 1: TI60F225C4; Supplier 1: Digi-Key; Supplier Part Number 1: 2134-TI60F225C4-ND

## Sheet 11_MEM_HYPERRAM_FLASH.SchDoc
size A3; DocumentNumber: 11; SheetNumber: 11; SheetTotal: 21
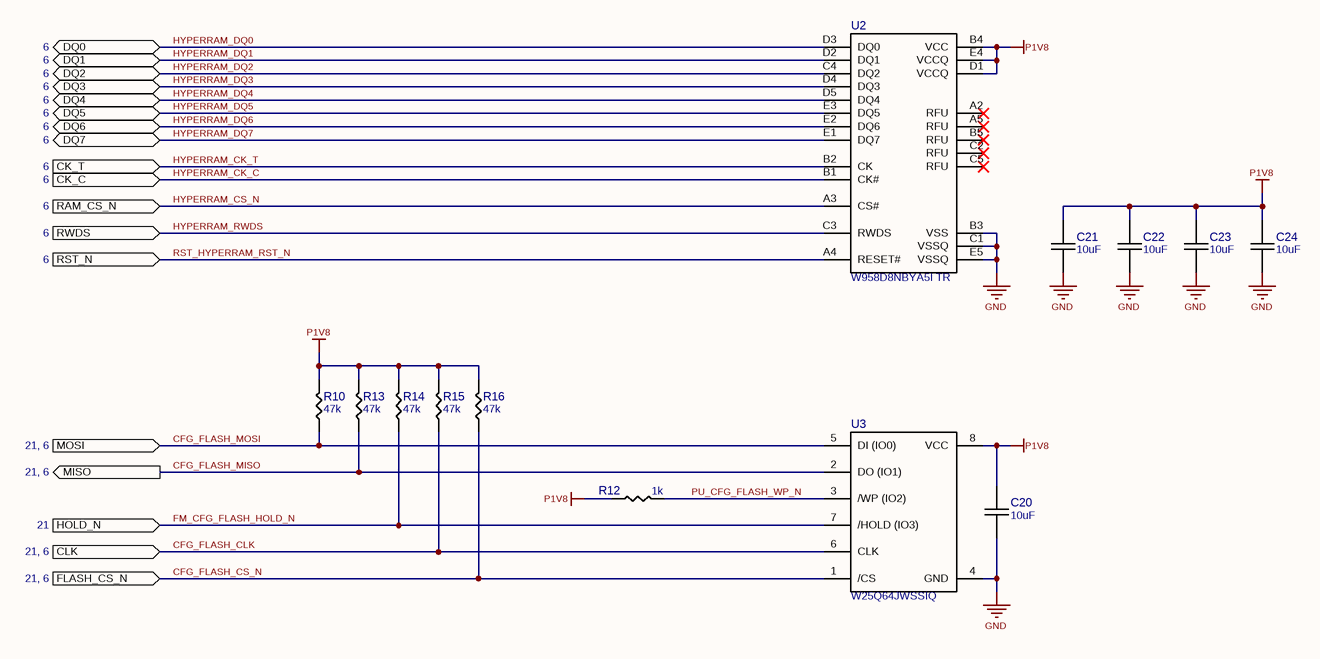
[diagram p10: 11_MEM_HYPERRAM_FLASH.SchDoc]

### Parts
C20  10uF  [CAPC1005X06N]
C21  10uF  [CAPC1005X06N]
C22  10uF  [CAPC1005X06N]
C23  10uF  [CAPC1005X06N]
C24  10uF  [CAPC1005X06N]
R10  47k  [RESC1005X03N]
R12  1k  [RESC1005X03N]
R13  47k  [RESC1005X03N]
R14  47k  [RESC1005X03N]
R15  47k  [RESC1005X03N]
R16  47k  [RESC1005X03N]
U2  W958D8NBYA5I TR  [BGA24C100P5X5_600X800X120]
U3  W25Q64JWSSIQ  [SOIC127P590X175-8N]

### Ports
CK_C (in, see 6), CK_T (in, see 6), CLK (in, see 21, 6), DQ0 (bidir, see 6), DQ1 (bidir, see 6), DQ2 (bidir, see 6), DQ3 (bidir, see 6), DQ4 (bidir, see 6), DQ5 (bidir, see 6), DQ6 (bidir, see 6), DQ7 (bidir, see 6), FLASH_CS_N (in, see 21, 6), HOLD_N (in, see 21), MISO (out, see 21, 6), MOSI (in, see 21, 6), RAM_CS_N (in, see 6), RST_N (in, see 6), RWDS (in, see 6)

### Nets
GND: C20.1 C21.1 C22.1 C23.1 C24.1 U2.B3(VSS) U2.C1(VSSQ) U2.E5(VSSQ) U3.4(GND)
P1V8: C20.2 C21.2 C22.2 C23.2 C24.2 R10.2 R12.1 R13.2 R14.2 R15.2 R16.2 U2.B4(VCC) U2.D1(VCCQ) U2.E4(VCCQ) U3.8(VCC)
CFG_FLASH_CLK: R15.1 U3.6(CLK) ; port CLK
CFG_FLASH_CS_N: R16.1 U3.1(/CS) ; port FLASH_CS_N
CFG_FLASH_MISO: R13.1 U3.2(DO_(IO1)) ; port MISO
CFG_FLASH_MOSI: R10.1 U3.5(DI_(IO0)) ; port MOSI
FM_CFG_FLASH_HOLD_N: R14.1 U3.7(/HOLD_(IO3)) ; port HOLD_N
HYPERRAM_CK_C: U2.B1(CK#) ; port CK_C
HYPERRAM_CK_T: U2.B2(CK) ; port CK_T
HYPERRAM_CS_N: U2.A3(CS#) ; port RAM_CS_N
HYPERRAM_DQ0: U2.D3(DQ0) ; port DQ0
HYPERRAM_DQ1: U2.D2(DQ1) ; port DQ1
HYPERRAM_DQ2: U2.C4(DQ2) ; port DQ2
HYPERRAM_DQ3: U2.D4(DQ3) ; port DQ3
HYPERRAM_DQ4: U2.D5(DQ4) ; port DQ4
HYPERRAM_DQ5: U2.E3(DQ5) ; port DQ5
HYPERRAM_DQ6: U2.E2(DQ6) ; port DQ6
HYPERRAM_DQ7: U2.E1(DQ7) ; port DQ7
HYPERRAM_RWDS: U2.C3(RWDS) ; port RWDS
PU_CFG_FLASH_WP_N: R12.2 U3.3(/WP_(IO2))
RST_HYPERRAM_RST_N: U2.A4(RESET#) ; port RST_N

Not connected (* = marked no-connect by the designer): U2 A2(RFU)* A5(RFU)* B5(RFU)* C2(RFU)* C5(RFU)*

### Library data of the parts
C20-C24 = GRM155R60J106ME47D: as C1 on sheet 10_FPGA_PWR; Part Number: GRM155R60J106ME47D; Value: 10uF; Voltage: 6.3V; TempC: X5R; Manufacturer Part Number 1: GRM155R60J106ME47D; Supplier 1: Digi-Key; Supplier Part Number 1: 490-13239-1-ND
R10 R13-R16 = RC0402FR-0747KL: RES SMD 47K OHM 1% 1/16W 0402; Manufacturer 1: Yageo; Part Number: RC0402FR-0747KL; Value: 47k; Tol: 1%; Manufacturer Part Number 1: RC0402FR-0747KL; Supplier 1: Digi-Key; Supplier Part Number 1: 311-47.0KLRCT-ND
R12 = RC0402FR-071KL: RES SMD 1K OHM 1% 1/16W 0402; Manufacturer 1: Yageo; Part Number: RC0402FR-071KL; Value: 1k; Tol: 1%; Manufacturer Part Number 1: RC0402FR-071KL; Supplier 1: Digi-Key; Supplier Part Number 1: 311-1.00KLRCT-ND
U2 = W958D8NBYA5I TR: 256MB HYPERRAM X8, 200MHZ, IND T; Manufacturer 1: Winbond Electronics; Part Number: W958D8NBYA5I TR; Manufacturer Part Number 1: W958D8NBYA5I TR; Supplier 1: Digi-Key; Supplier Part Number 1: 256-W958D8NBYA5ITRCT-ND
U3 = W25Q64JWSSIQ: IC FLASH 64MBIT SPI/QUAD 8SOIC; Manufacturer 1: Winbond Electronics; Part Number: W25Q64JWSSIQ; Manufacturer Part Number 1: W25Q64JWSSIQ; Supplier 1: Digi-Key; Supplier Part Number 1: 256-W25Q64JWSSIQ-ND

## Sheet 12_MEM_DDR3.SchDoc
size A3; DocumentNumber: 12; SheetNumber: 12; SheetTotal: 21
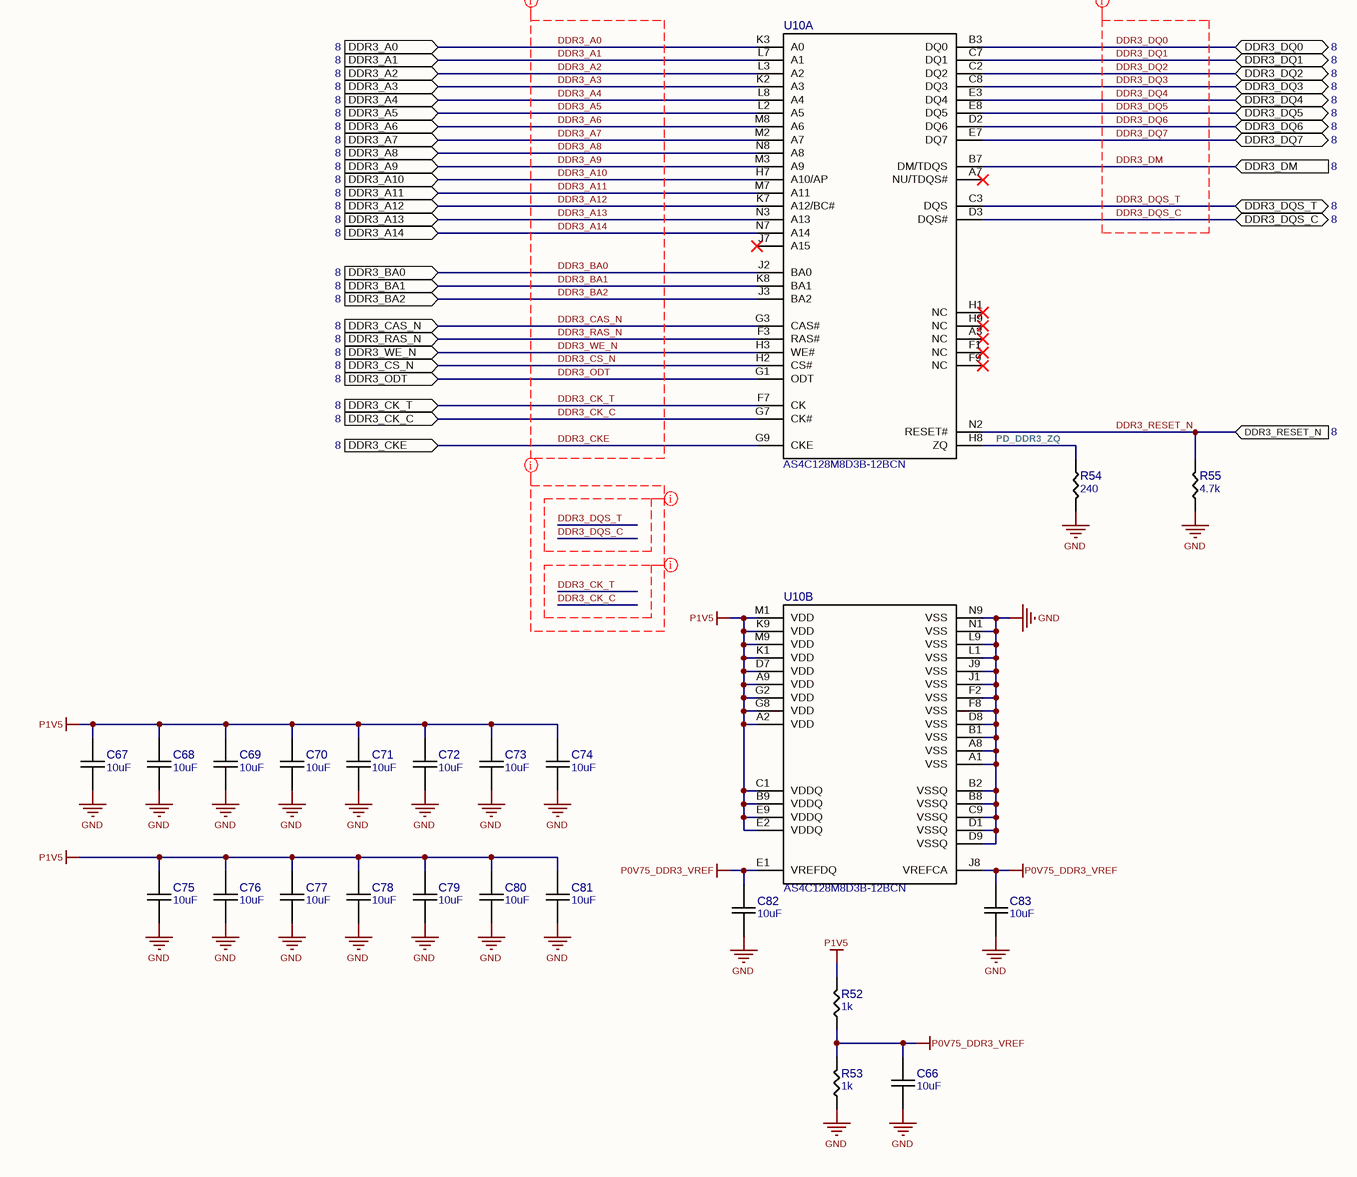
[diagram p11: 12_MEM_DDR3.SchDoc]

### Parts
C66  10uF  [CAPC1005X06N]
C67  10uF  [CAPC1005X06N]
C68  10uF  [CAPC1005X06N]
C69  10uF  [CAPC1005X06N]
C70  10uF  [CAPC1005X06N]
C71  10uF  [CAPC1005X06N]
C72  10uF  [CAPC1005X06N]
C73  10uF  [CAPC1005X06N]
C74  10uF  [CAPC1005X06N]
C75  10uF  [CAPC1005X06N]
C76  10uF  [CAPC1005X06N]
C77  10uF  [CAPC1005X06N]
C78  10uF  [CAPC1005X06N]
C79  10uF  [CAPC1005X06N]
C80  10uF  [CAPC1005X06N]
C81  10uF  [CAPC1005X06N]
C82  10uF  [CAPC1005X06N]
C83  10uF  [CAPC1005X06N]
R52  1k  [RESC1005X03N]
R53  1k  [RESC1005X03N]
R54  240  [RESC1005X03N]
R55  4.7k  [RESC1005X03N]
U10  AS4C128M8D3B-12BCN  [BGA78C80P9X13_800X1050X100]  (parts A,B of 2)

### Ports
DDR3_A0 (in, see 8), DDR3_A1 (in, see 8), DDR3_A2 (in, see 8), DDR3_A3 (in, see 8), DDR3_A4 (in, see 8), DDR3_A5 (in, see 8), DDR3_A6 (in, see 8), DDR3_A7 (in, see 8), DDR3_A8 (in, see 8), DDR3_A9 (in, see 8), DDR3_A10 (in, see 8), DDR3_A11 (in, see 8), DDR3_A12 (in, see 8), DDR3_A13 (in, see 8), DDR3_A14 (in, see 8), DDR3_BA0 (in, see 8), DDR3_BA1 (in, see 8), DDR3_BA2 (in, see 8), DDR3_CAS_N (in, see 8), DDR3_CK_C (in, see 8), DDR3_CK_T (in, see 8), DDR3_CKE (in, see 8), DDR3_CS_N (in, see 8), DDR3_DM (in, see 8), DDR3_DQ0 (bidir, see 8), DDR3_DQ1 (bidir, see 8), DDR3_DQ2 (bidir, see 8), DDR3_DQ3 (bidir, see 8), DDR3_DQ4 (bidir, see 8), DDR3_DQ5 (bidir, see 8), DDR3_DQ6 (bidir, see 8), DDR3_DQ7 (bidir, see 8), DDR3_DQS_C (bidir, see 8), DDR3_DQS_T (bidir, see 8), DDR3_ODT (in, see 8), DDR3_RAS_N (in, see 8), DDR3_RESET_N (in, see 8), DDR3_WE_N (in, see 8)

### Nets
GND: C66.1 C67.1 C68.1 C69.1 C70.1 C71.1 C72.1 C73.1 C74.1 C75.1 C76.1 C77.1 C78.1 C79.1 C80.1 C81.1 C82.1 C83.1 R53.1 R54.2 R55.1 U10.A1(VSS) U10.A8(VSS) U10.B1(VSS) U10.B2(VSSQ) U10.B8(VSSQ) U10.C9(VSSQ) U10.D1(VSSQ) U10.D8(VSS) U10.D9(VSSQ) U10.F2(VSS) U10.F8(VSS) U10.J1(VSS) U10.J9(VSS) U10.L1(VSS) U10.L9(VSS) U10.N1(VSS) U10.N9(VSS)
P0V75_DDR3_VREF: C66.2 C82.2 C83.2 R52.1 R53.2 U10.E1(VREFDQ) U10.J8(VREFCA)
P1V5: C67.2 C68.2 C69.2 C70.2 C71.2 C72.2 C73.2 C74.2 C75.2 C76.2 C77.2 C78.2 C79.2 C80.2 C81.2 R52.2 U10.A2(VDD) U10.A9(VDD) U10.B9(VDDQ) U10.C1(VDDQ) U10.D7(VDD) U10.E2(VDDQ) U10.E9(VDDQ) U10.G2(VDD) U10.G8(VDD) U10.K1(VDD) U10.K9(VDD) U10.M1(VDD) U10.M9(VDD)
DDR3_A0: U10.K3(A0) ; port DDR3_A0
DDR3_A1: U10.L7(A1) ; port DDR3_A1
DDR3_A2: U10.L3(A2) ; port DDR3_A2
DDR3_A3: U10.K2(A3) ; port DDR3_A3
DDR3_A4: U10.L8(A4) ; port DDR3_A4
DDR3_A5: U10.L2(A5) ; port DDR3_A5
DDR3_A6: U10.M8(A6) ; port DDR3_A6
DDR3_A7: U10.M2(A7) ; port DDR3_A7
DDR3_A8: U10.N8(A8) ; port DDR3_A8
DDR3_A9: U10.M3(A9) ; port DDR3_A9
DDR3_A10: U10.H7(A10/AP) ; port DDR3_A10
DDR3_A11: U10.M7(A11) ; port DDR3_A11
DDR3_A12: U10.K7(A12/BC#) ; port DDR3_A12
DDR3_A13: U10.N3(A13) ; port DDR3_A13
DDR3_A14: U10.N7(A14) ; port DDR3_A14
DDR3_BA0: U10.J2(BA0) ; port DDR3_BA0
DDR3_BA1: U10.K8(BA1) ; port DDR3_BA1
DDR3_BA2: U10.J3(BA2) ; port DDR3_BA2
DDR3_CAS_N: U10.G3(CAS#) ; port DDR3_CAS_N
DDR3_CK_C: U10.G7(CK#) ; port DDR3_CK_C
DDR3_CK_T: U10.F7(CK) ; port DDR3_CK_T
DDR3_CKE: U10.G9(CKE) ; port DDR3_CKE
DDR3_CS_N: U10.H2(CS#) ; port DDR3_CS_N
DDR3_DM: U10.B7(DM/TDQS) ; port DDR3_DM
DDR3_DQ0: U10.B3(DQ0) ; port DDR3_DQ0
DDR3_DQ1: U10.C7(DQ1) ; port DDR3_DQ1
DDR3_DQ2: U10.C2(DQ2) ; port DDR3_DQ2
DDR3_DQ3: U10.C8(DQ3) ; port DDR3_DQ3
DDR3_DQ4: U10.E3(DQ4) ; port DDR3_DQ4
DDR3_DQ5: U10.E8(DQ5) ; port DDR3_DQ5
DDR3_DQ6: U10.D2(DQ6) ; port DDR3_DQ6
DDR3_DQ7: U10.E7(DQ7) ; port DDR3_DQ7
DDR3_DQS_C: U10.D3(DQS#) ; port DDR3_DQS_C
DDR3_DQS_T: U10.C3(DQS) ; port DDR3_DQS_T
DDR3_ODT: U10.G1(ODT) ; port DDR3_ODT
DDR3_RAS_N: U10.F3(RAS#) ; port DDR3_RAS_N
DDR3_RESET_N: R55.2 U10.N2(RESET#) ; port DDR3_RESET_N
DDR3_WE_N: U10.H3(WE#) ; port DDR3_WE_N
PD_DDR3_ZQ: R54.1 U10.H8(ZQ)

Not connected (* = marked no-connect by the designer): U10 A3(NC)* A7(NU/TDQS#)* F1(NC)* F9(NC)* H1(NC)* H9(NC)* J7(A15)*

### Layout directives
net class DDR3_DQ: DDR3_DM, DDR3_DQ0, DDR3_DQ1, DDR3_DQ2, DDR3_DQ3, DDR3_DQ4, DDR3_DQ5, DDR3_DQ6, DDR3_DQ7, DDR3_DQS_C, DDR3_DQS_T
net class DDR3_CA: DDR3_A0, DDR3_A1, DDR3_A2, DDR3_A3, DDR3_A4, DDR3_A5, DDR3_A6, DDR3_A7, DDR3_A8, DDR3_A9, DDR3_A10, DDR3_A11, DDR3_A12, DDR3_A13, DDR3_A14, DDR3_BA0, DDR3_BA1, DDR3_BA2, DDR3_CAS_N, DDR3_CK_C, DDR3_CK_T, DDR3_CKE, DDR3_CS_N, DDR3_ODT, DDR3_RAS_N, DDR3_WE_N
net class DDR3_DQS: DDR3_DQS_C, DDR3_DQS_T
net class DDR3_CK: DDR3_CK_C, DDR3_CK_T
net class DDR3_CLK: DDR3_CK_C, DDR3_CK_T, DDR3_DQS_C, DDR3_DQS_T

### Library data of the parts
C66-C83 = GRM155R60J106ME47D: as C1 on sheet 10_FPGA_PWR; Part Number: GRM155R60J106ME47D; Value: 10uF; Voltage: 6.3V; TempC: X5R; Manufacturer Part Number 1: GRM155R60J106ME47D; Supplier 1: Digi-Key; Supplier Part Number 1: 490-13239-1-ND
R52 R53 = RC0402FR-071KL: as R12 on sheet 11_MEM_HYPERRAM_FLASH; Part Number: RC0402FR-071KL; Value: 1k; Tol: 1%; Manufacturer Part Number 1: RC0402FR-071KL; Supplier 1: Digi-Key; Supplier Part Number 1: 311-1.00KLRCT-ND
R54 = RC0402FR-07240RL: RES SMD 240 OHM 1% 1/16W 0402; Manufacturer 1: Yageo; Part Number: RC0402FR-07240RL; Value: 240; Tol: 1%; Manufacturer Part Number 1: RC0402FR-07240RL; Supplier 1: Digi-Key; Supplier Part Number 1: 311-240LRCT-ND
R55 = RC0402FR-074K7L: RES SMD 4.7K OHM 1% 1/16W 0402; Manufacturer 1: Yageo; Part Number: RC0402FR-074K7L; Value: 4.7k; Tol: 1%; Manufacturer Part Number 1: RC0402FR-074K7L; Supplier 1: Digi-Key; Supplier Part Number 1: 311-4.7KLRCT-ND
U10 = AS4C128M8D3B-12BCN: IC DRAM 1GBIT PARALLEL 78FBGA; Manufacturer 1: Alliance Memory, Inc.; Part Number: AS4C128M8D3B-12BCN; Manufacturer Part Number 1: AS4C128M8D3B-12BCN; Supplier 1: Digi-Key; Supplier Part Number 1: 1450-1447-ND

## Sheet 13_IO_ETH.SchDoc
size A3; DocumentNumber: 13; SheetNumber: 13; SheetTotal: 21
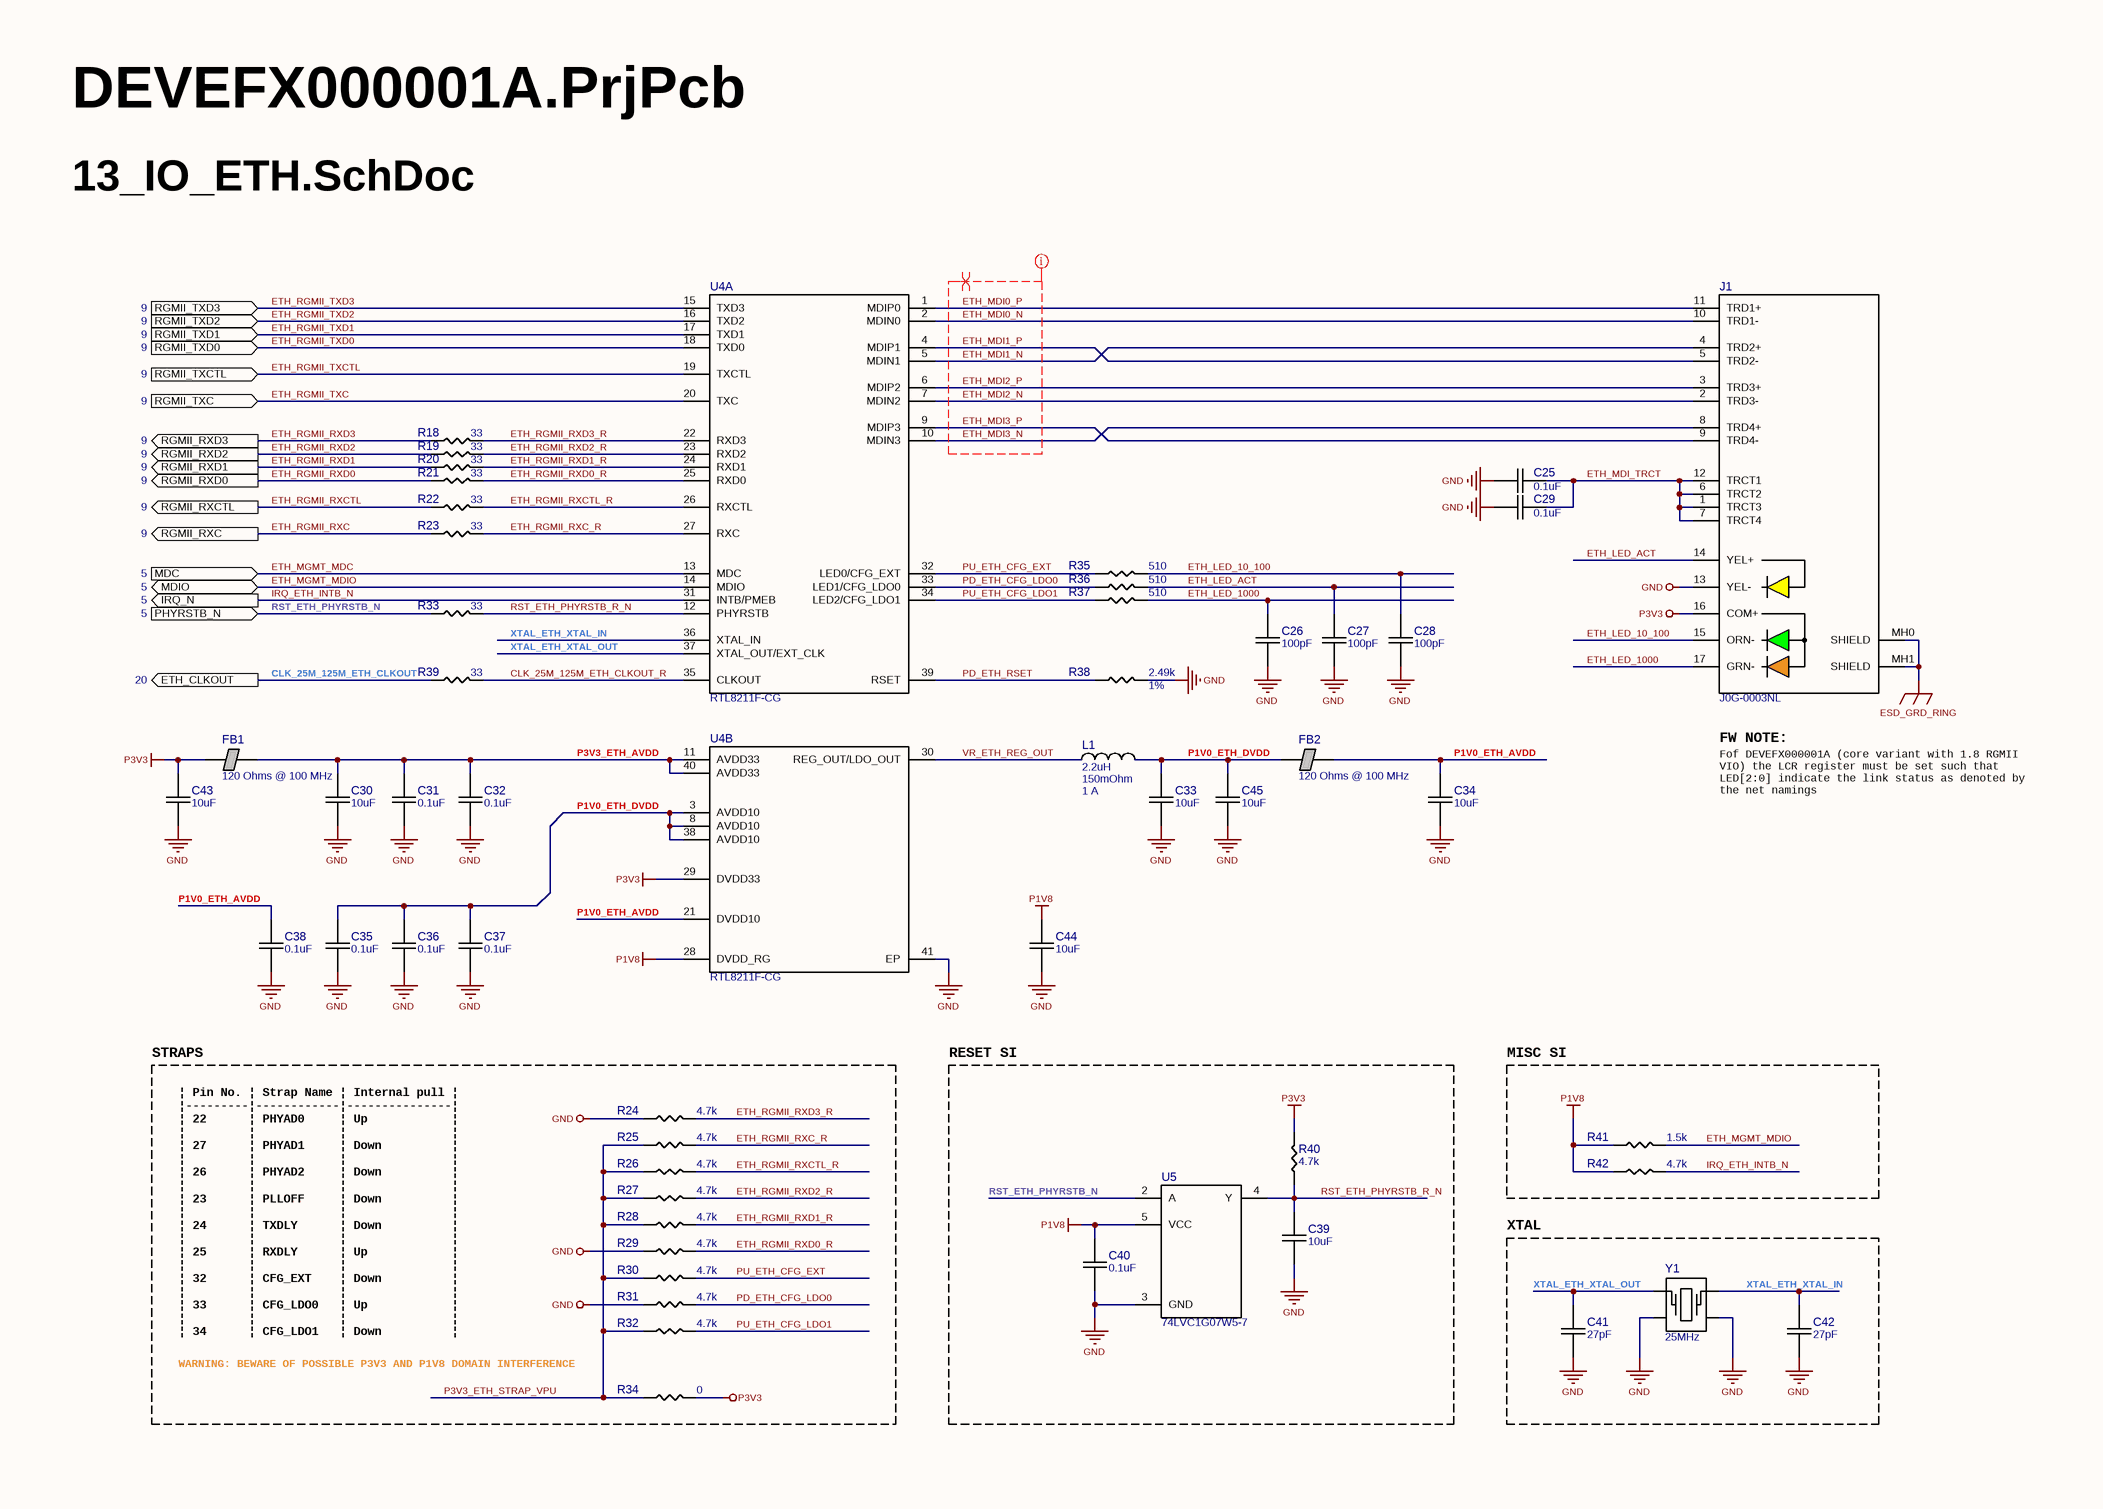
[diagram p12: 13_IO_ETH.SchDoc]

### Parts
C25  0.1uF  [CAPC1005X06N]
C26  100pF  [CAPC1005X06N]
C27  100pF  [CAPC1005X06N]
C28  100pF  [CAPC1005X06N]
C29  0.1uF  [CAPC1005X06N]
C30  10uF  [CAPC1005X06N]
C31  0.1uF  [CAPC1005X06N]
C32  0.1uF  [CAPC1005X06N]
C33  10uF  [CAPC1005X06N]
C34  10uF  [CAPC1005X06N]
C35  0.1uF  [CAPC1005X06N]
C36  0.1uF  [CAPC1005X06N]
C37  0.1uF  [CAPC1005X06N]
C38  0.1uF  [CAPC1005X06N]
C39  10uF  [CAPC1005X06N]
C40  0.1uF  [CAPC1005X06N]
C41  27pF  [CAPC1005X06N]
C42  27pF  [CAPC1005X06N]
C43  10uF  [CAPC1005X06N]
C44  10uF  [CAPC1005X06N]
C45  10uF  [CAPC1005X06N]
FB1  120 Ohms @ 100 MHz  [INDC1005X05N]
FB2  120 Ohms @ 100 MHz  [INDC1005X05N]
J1  J0G-0003NL  [PULSE_J0G-0003NL]
L1  2.2uH  DCR: 150mOhm  Ir: 1 A  [INDC2520X12N]
R18  33  [RESC1005X03N]
R19  33  [RESC1005X03N]
R20  33  [RESC1005X03N]
R21  33  [RESC1005X03N]
R22  33  [RESC1005X03N]
R23  33  [RESC1005X03N]
R24  4.7k  [RESC1005X03N]
R25  4.7k  [RESC1005X03N]
R26  4.7k  [RESC1005X03N]
R27  4.7k  [RESC1005X03N]
R28  4.7k  [RESC1005X03N]
R29  4.7k  [RESC1005X03N]
R30  4.7k  [RESC1005X03N]
R31  4.7k  [RESC1005X03N]
R32  4.7k  [RESC1005X03N]
R33  33  [RESC1005X03N]
R34  0  [RESC1005X03N]
R35  510  [RESC1005X03N]
R36  510  [RESC1005X03N]
R37  510  [RESC1005X03N]
R38  2.49k  Tol: 1%  [RESC1005X03N]
R39  33  [RESC1005X03N]
R40  4.7k  [RESC1005X03N]
R41  1.5k  [RESC1005X03N]
R42  4.7k  [RESC1005X03N]
U4  RTL8211F-CG  [QFN40P500X500X90_HS-41N]  (parts A,B of 2)
U5  74LVC1G07W5-7  [SOT95P280X145-5N]
Y1  25MHz  [XTAL_3225]

### Blocks framed on the sheet
STRAPS: R24-R32 R34
RESET SI: C39 C40 R40 U5
MISC SI: R41 R42
XTAL: C41 C42 Y1

### Ports
ETH_CLKOUT (out, see 20), IRQ_N (out, see 5), MDC (in, see 5), MDIO (bidir, see 5), PHYRSTB_N (in, see 5), RGMII_RXC (out, see 9), RGMII_RXCTL (out, see 9), RGMII_RXD0 (out, see 9), RGMII_RXD1 (out, see 9), RGMII_RXD2 (out, see 9), RGMII_RXD3 (out, see 9), RGMII_TXC (in, see 9), RGMII_TXCTL (in, see 9), RGMII_TXD0 (in, see 9), RGMII_TXD1 (in, see 9), RGMII_TXD2 (in, see 9), RGMII_TXD3 (in, see 9)

### Nets
ESD_GRD_RING: J1.MH0(SHIELD) J1.MH1(SHIELD)
GND: C25.1 C26.1 C27.1 C28.1 C29.1 C30.1 C31.1 C32.1 C33.1 C34.1 C35.1 C36.1 C37.1 C38.1 C39.1 C40.1 C41.1 C42.1 C43.1 C44.1 C45.1 J1.13(YEL-) R24.1 R29.1 R31.1 R38.2 U4.41(EP) U5.3(GND) Y1.2 Y1.4
P1V8: C40.2 C44.2 R41.1 R42.1 U4.28(DVDD_RG) U5.5(VCC)
P3V3: C43.2 FB1.1 J1.16(COM+) R34.2 R40.2 U4.29(DVDD33)
CLK_25M_125M_ETH_CLKOUT: R39.1 ; port ETH_CLKOUT
CLK_25M_125M_ETH_CLKOUT_R: R39.2 U4.35(CLKOUT)
ETH_LED_10_100: C28.2 J1.15(ORN-) R35.2
ETH_LED_1000: C26.2 J1.17(GRN-) R37.2
ETH_LED_ACT: C27.2 J1.14(YEL+) R36.2
ETH_MDI0_N: J1.10(TRD1-) U4.2(MDIN0)
ETH_MDI0_P: J1.11(TRD1+) U4.1(MDIP0)
ETH_MDI1_N: J1.4(TRD2+) U4.5(MDIN1)
ETH_MDI1_P: J1.5(TRD2-) U4.4(MDIP1)
ETH_MDI2_N: J1.2(TRD3-) U4.7(MDIN2)
ETH_MDI2_P: J1.3(TRD3+) U4.6(MDIP2)
ETH_MDI3_N: J1.8(TRD4+) U4.10(MDIN3)
ETH_MDI3_P: J1.9(TRD4-) U4.9(MDIP3)
ETH_MDI_TRCT: C25.2 C29.2 J1.1(TRCT3) J1.6(TRCT2) J1.7(TRCT4) J1.12(TRCT1)
ETH_MGMT_MDC: U4.13(MDC) ; port MDC
ETH_MGMT_MDIO: R41.2 U4.14(MDIO) ; port MDIO
ETH_RGMII_RXC: R23.1 ; port RGMII_RXC
ETH_RGMII_RXC_R: R23.2 R25.2 U4.27(RXC)
ETH_RGMII_RXCTL: R22.1 ; port RGMII_RXCTL
ETH_RGMII_RXCTL_R: R22.2 R26.2 U4.26(RXCTL)
ETH_RGMII_RXD0: R21.1 ; port RGMII_RXD0
ETH_RGMII_RXD0_R: R21.2 R29.2 U4.25(RXD0)
ETH_RGMII_RXD1: R20.1 ; port RGMII_RXD1
ETH_RGMII_RXD1_R: R20.2 R28.2 U4.24(RXD1)
ETH_RGMII_RXD2: R19.1 ; port RGMII_RXD2
ETH_RGMII_RXD2_R: R19.2 R27.2 U4.23(RXD2)
ETH_RGMII_RXD3: R18.1 ; port RGMII_RXD3
ETH_RGMII_RXD3_R: R18.2 R24.2 U4.22(RXD3)
ETH_RGMII_TXC: U4.20(TXC) ; port RGMII_TXC
ETH_RGMII_TXCTL: U4.19(TXCTL) ; port RGMII_TXCTL
ETH_RGMII_TXD0: U4.18(TXD0) ; port RGMII_TXD0
ETH_RGMII_TXD1: U4.17(TXD1) ; port RGMII_TXD1
ETH_RGMII_TXD2: U4.16(TXD2) ; port RGMII_TXD2
ETH_RGMII_TXD3: U4.15(TXD3) ; port RGMII_TXD3
IRQ_ETH_INTB_N: R42.2 U4.31(INTB/PMEB) ; port IRQ_N
P1V0_ETH_AVDD: C34.2 C38.2 FB2.2 U4.21(DVDD10)
P1V0_ETH_DVDD: C33.2 C35.2 C36.2 C37.2 C45.2 FB2.1 L1.2 U4.3(AVDD10) U4.8(AVDD10) U4.38(AVDD10)
P3V3_ETH_AVDD: C30.2 C31.2 C32.2 FB1.2 U4.11(AVDD33) U4.40(AVDD33)
P3V3_ETH_STRAP_VPU: R25.1 R26.1 R27.1 R28.1 R30.1 R32.1 R34.1
PD_ETH_CFG_LDO0: R31.2 R36.1 U4.33(LED1/CFG_LDO0)
PD_ETH_RSET: R38.1 U4.39(RSET)
PU_ETH_CFG_EXT: R30.2 R35.1 U4.32(LED0/CFG_EXT)
PU_ETH_CFG_LDO1: R32.2 R37.1 U4.34(LED2/CFG_LDO1)
RST_ETH_PHYRSTB_N: R33.1 U5.2(A) ; port PHYRSTB_N
RST_ETH_PHYRSTB_R_N: C39.2 R33.2 R40.1 U4.12(PHYRSTB) U5.4(Y)
VR_ETH_REG_OUT: L1.1 U4.30(REG_OUT/LDO_OUT)
XTAL_ETH_XTAL_IN: C42.2 U4.36(XTAL_IN) Y1.3
XTAL_ETH_XTAL_OUT: C41.2 U4.37(XTAL_OUT/EXT_CLK) Y1.1

### Layout directives
differential pair; differential pair class 100D: ETH_MDI0_N, ETH_MDI0_P, ETH_MDI1_N, ETH_MDI1_P, ETH_MDI2_N, ETH_MDI2_P, ETH_MDI3_N, ETH_MDI3_P
net class MDI: ETH_MDI0_N, ETH_MDI0_P, ETH_MDI1_N, ETH_MDI1_P, ETH_MDI2_N, ETH_MDI2_P, ETH_MDI3_N, ETH_MDI3_P

### Notes on the sheet
- FW NOTE:
- Fof DEVEFX000001A (core variant with 1.8 RGMII VIO) the LCR register must be set such that LED[2:0] indicate the link status as denoted by the net namings
- | Pin No. | Strap Name | Internal pull |
- |---------|------------|---------------|
- | 22      | PHYAD0     | Up            |
- |         |            |               |
- | 27      | PHYAD1     | Down          |
- | 26      | PHYAD2     | Down          |
- | 23      | PLLOFF     | Down          |
- | 24      | TXDLY      | Down          |
- | 25      | RXDLY      | Up            |
- | 32      | CFG_EXT    | Down          |
- | 33      | CFG_LDO0   | Up            |
- | 34      | CFG_LDO1   | Down          |
- WARNING: BEWARE OF POSSIBLE P3V3 AND P1V8 DOMAIN INTERFERENCE

### Library data of the parts
C25 C29 C31 C32 C35-C38 C40 = GRM155R71E104KE14J: CAP CER 0.1UF 25V X7R 0402; Manufacturer 1: Murata Electronics; Tol: 10%; Part Number: GRM155R71E104KE14J; Value: 0.1uF; Voltage: 25V; TempC: X7R; Manufacturer Part Number 1: GRM155R71E104KE14J; Supplier 1: Digi-Key; Supplier Part Number 1: 490-14603-1-ND
C26-C28 = GCM1555C1H101FA16J: CAP CER 100PF 50V C0G/NP0 0402; Manufacturer 1: Murata Electronics; Tol: 1%; Part Number: GCM1555C1H101FA16J; Value: 100pF; Voltage: 50V; TempC: C0G/NP0; Manufacturer Part Number 1: GCM1555C1H101FA16J; Supplier 1: Digi-Key; Supplier Part Number 1: 490-GCM1555C1H101FA16JTR-ND
C30 C33 C34 C39 C43-C45 = GRM155R60J106ME47D: as C1 on sheet 10_FPGA_PWR; Part Number: GRM155R60J106ME47D; Value: 10uF; Voltage: 6.3V; TempC: X5R; Manufacturer Part Number 1: GRM155R60J106ME47D; Supplier 1: Digi-Key; Supplier Part Number 1: 490-13239-1-ND
C41 C42 = CC0402JRNPO9BN270: CAP CER 27PF 50V C0G/NPO 0402; Manufacturer 1: Yageo; Tol: 5%; TempC: C0G/NP0; Part Number: CC0402JRNPO9BN270; Value: 27pF; Voltage: 50V; Manufacturer Part Number 1: CC0402JRNPO9BN270; Supplier 1: Digi-Key; Supplier Part Number 1: 311-1019-1-ND
FB1 FB2 = BLM15PD121SN1D: as FB3 on sheet 10_FPGA_PWR; Part Number: BLM15PD121SN1D; Value: 120 Ohms @ 100 MHz; Manufacturer Part Number 1: BLM15PD121SN1D; Supplier 1: Digi-Key; Supplier Part Number 1: 490-5203-1-ND
J1 = J0G-0003NL: CONN JACK 1PORT 1000 BASE-T PCB; Manufacturer 1: Pulse Electronics Network; Part Number: J0G-0003NL; Manufacturer Part Number 1: J0G-0003NL; Supplier 1: Digi-Key; Supplier Part Number 1: 553-1852-ND
L1 = LQM2HPN2R2MJ0L: FIXED IND 2.2UH 1A 150 MOHM SMD; Manufacturer 1: Murata Electronics; Part Number: LQM2HPN2R2MJ0L; Value: 2.2uH; Manufacturer Part Number 1: LQM2HPN2R2MJ0L; Supplier 1: Digi-Key; Supplier Part Number 1: 490-6700-1-ND
R18-R23 R33 R39 = RC0402FR-0733RL: as R62 on sheet 05_FPGA_HVIO; Part Number: RC0402FR-0733RL; Value: 33; Tol: 1%; Manufacturer Part Number 1: RC0402FR-0733RL; Supplier 1: Digi-Key; Supplier Part Number 1: 311-33.0LRCT-ND
R24-R32 R40 R42 = RC0402FR-074K7L: as R55 on sheet 12_MEM_DDR3; Part Number: RC0402FR-074K7L; Value: 4.7k; Tol: 1%; Manufacturer Part Number 1: RC0402FR-074K7L; Supplier 1: Digi-Key; Supplier Part Number 1: 311-4.7KLRCT-ND
R34 = RC0402FR-070RL: RES SMD 0 OHM JUMPER 1/16W 0402; Manufacturer 1: Yageo; Tol: 1%; Part Number: RC0402FR-070RL; Value: 0; Manufacturer Part Number 1: RC0402FR-070RL; Supplier 1: Digi-Key; Supplier Part Number 1: 311-0.0LRCT-ND
R35-R37 = RC0402JR-07510RL: RES 510 OHM 5% 1/16W 0402; Manufacturer 1: Yageo; Tol: 1%; Part Number: RC0402JR-07510RL; Value: 510; Manufacturer Part Number 1: RC0402JR-07510RL; Supplier 1: Digi-Key; Supplier Part Number 1: 311-510JRCT-ND
R38 = RC0402FR-072K49L: RES SMD 2.49K OHM 1% 1/16W 0402; Manufacturer 1: Yageo; Part Number: RC0402FR-072K49L; Value: 2.49k; Manufacturer Part Number 1: RC0402FR-072K49L; Supplier 1: Digi-Key; Supplier Part Number 1: 311-2.49KLRCT-ND
R41 = RC0402FR-071K5L: RES 1.5K OHM 1% 1/16W 0402; Manufacturer 1: Yageo; Part Number: RC0402FR-071K5L; Value: 1.5k; Tol: 1%; Manufacturer Part Number 1: RC0402FR-071K5L; Supplier 1: Digi-Key; Supplier Part Number 1: 311-1.50KLRCT-ND
U4 = RTL8211F-CG: Phy 1-CH 10MBPS/100MBPS/1GBPS 3.3V 40-PIN QFN Ep; Manufacturer 1: Realtek; Part Number: RTL8211F-CG; Manufacturer Part Number 1: RTL8211F-CG
U5 = 74LVC1G07W5-7: IC BUFFER NON-INVERT 5.5V SOT25; Manufacturer 1: Diodes Incorporated; Part Number: 74LVC1G07W5-7; Manufacturer Part Number 1: 74LVC1G07W5-7; Supplier 1: Digi-Key; Supplier Part Number 1: 74LVC1G07W5-7DICT-ND
Y1 = TSX-3225 25.0000MF10P-C0: CRYSTAL 25.0000MHZ 18PF SMD; Manufacturer 1: EPSON; Part Number: TSX-3225 25.0000MF10P-C0; Value: 25MHz; Manufacturer Part Number 1: TSX-3225 25.0000MF10P-C0; Supplier 1: Digi-Key; Supplier Part Number 1: SER4211TR-ND

## Sheet 14_IO_MIPI.SchDoc
size A3; DocumentNumber: 14; SheetNumber: 14; SheetTotal: 21
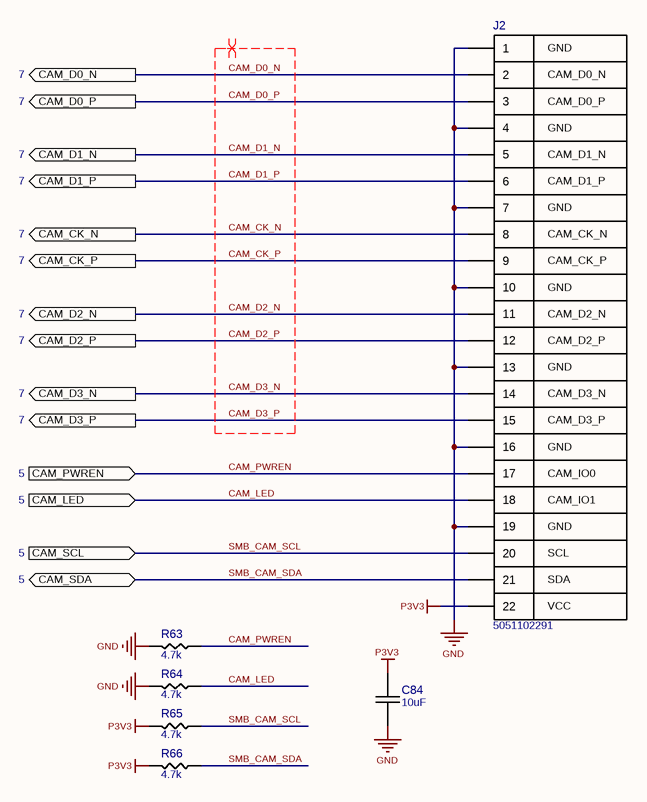
[diagram p13: 14_IO_MIPI.SchDoc]

### Parts
C84  10uF  [CAPC1005X06N]
J2  5051102291  [MOLEX_5051102291]
R63  4.7k  [RESC1005X03N]
R64  4.7k  [RESC1005X03N]
R65  4.7k  [RESC1005X03N]
R66  4.7k  [RESC1005X03N]

### Ports
CAM_CK_N (out, see 7), CAM_CK_P (out, see 7), CAM_D0_N (out, see 7), CAM_D0_P (out, see 7), CAM_D1_N (out, see 7), CAM_D1_P (out, see 7), CAM_D2_N (out, see 7), CAM_D2_P (out, see 7), CAM_D3_N (out, see 7), CAM_D3_P (out, see 7), CAM_LED (in, see 5), CAM_PWREN (in, see 5), CAM_SCL (in, see 5), CAM_SDA (bidir, see 5)

### Nets
GND: C84.1 J2.1 J2.4 J2.7 J2.10 J2.13 J2.16 J2.19 R63.2 R64.2
P3V3: C84.2 J2.22 R65.2 R66.2
CAM_CK_N: J2.8 ; port CAM_CK_N
CAM_CK_P: J2.9 ; port CAM_CK_P
CAM_D0_N: J2.2 ; port CAM_D0_N
CAM_D0_P: J2.3 ; port CAM_D0_P
CAM_D1_N: J2.5 ; port CAM_D1_N
CAM_D1_P: J2.6 ; port CAM_D1_P
CAM_D2_N: J2.11 ; port CAM_D2_N
CAM_D2_P: J2.12 ; port CAM_D2_P
CAM_D3_N: J2.14 ; port CAM_D3_N
CAM_D3_P: J2.15 ; port CAM_D3_P
CAM_LED: J2.18 R64.1 ; port CAM_LED
CAM_PWREN: J2.17 R63.1 ; port CAM_PWREN
SMB_CAM_SCL: J2.20 R65.1 ; port CAM_SCL
SMB_CAM_SDA: J2.21 R66.1 ; port CAM_SDA

### Layout directives
differential pair; differential pair class 100D: CAM_CK_N, CAM_CK_P, CAM_D0_N, CAM_D0_P, CAM_D1_N, CAM_D1_P, CAM_D2_N, CAM_D2_P, CAM_D3_N, CAM_D3_P

### Notes on the sheet
- (near J2) GND
- (near J2) CAM_D0_N
- (near J2) CAM_D0_P
- (near J2) CAM_D1_N
- (near J2) CAM_D1_P
- (near J2) CAM_CK_N
- (near J2) CAM_CK_P
- (near J2) CAM_D2_N
- (near J2) CAM_D2_P
- (near J2) CAM_D3_N
- (near J2) CAM_D3_P
- (near J2) CAM_IO0
- (near J2) CAM_IO1
- (near J2) SCL
- (near J2) SDA
- (near J2) VCC

### Library data of the parts
C84 = GRM155R60J106ME47D: as C1 on sheet 10_FPGA_PWR; Part Number: GRM155R60J106ME47D; Value: 10uF; Voltage: 6.3V; TempC: X5R; Manufacturer Part Number 1: GRM155R60J106ME47D; Supplier 1: Digi-Key; Supplier Part Number 1: 490-13239-1-ND
J2 = 5051102291: CONN FFC/FPC BOTTOM 22P .5MM R/A; Manufacturer 1: Molex; Part Number: 5051102291; Manufacturer Part Number 1: 5051102291; Supplier 1: Digi-Key; Supplier Part Number 1: WM11288CT-ND
R63-R66 = RC0402FR-074K7L: as R55 on sheet 12_MEM_DDR3; Part Number: RC0402FR-074K7L; Value: 4.7k; Tol: 1%; Manufacturer Part Number 1: RC0402FR-074K7L; Supplier 1: Digi-Key; Supplier Part Number 1: 311-4.7KLRCT-ND

## Sheet 15_IO_USB.SchDoc
size A3; DocumentNumber: 15; SheetNumber: 15; SheetTotal: 21
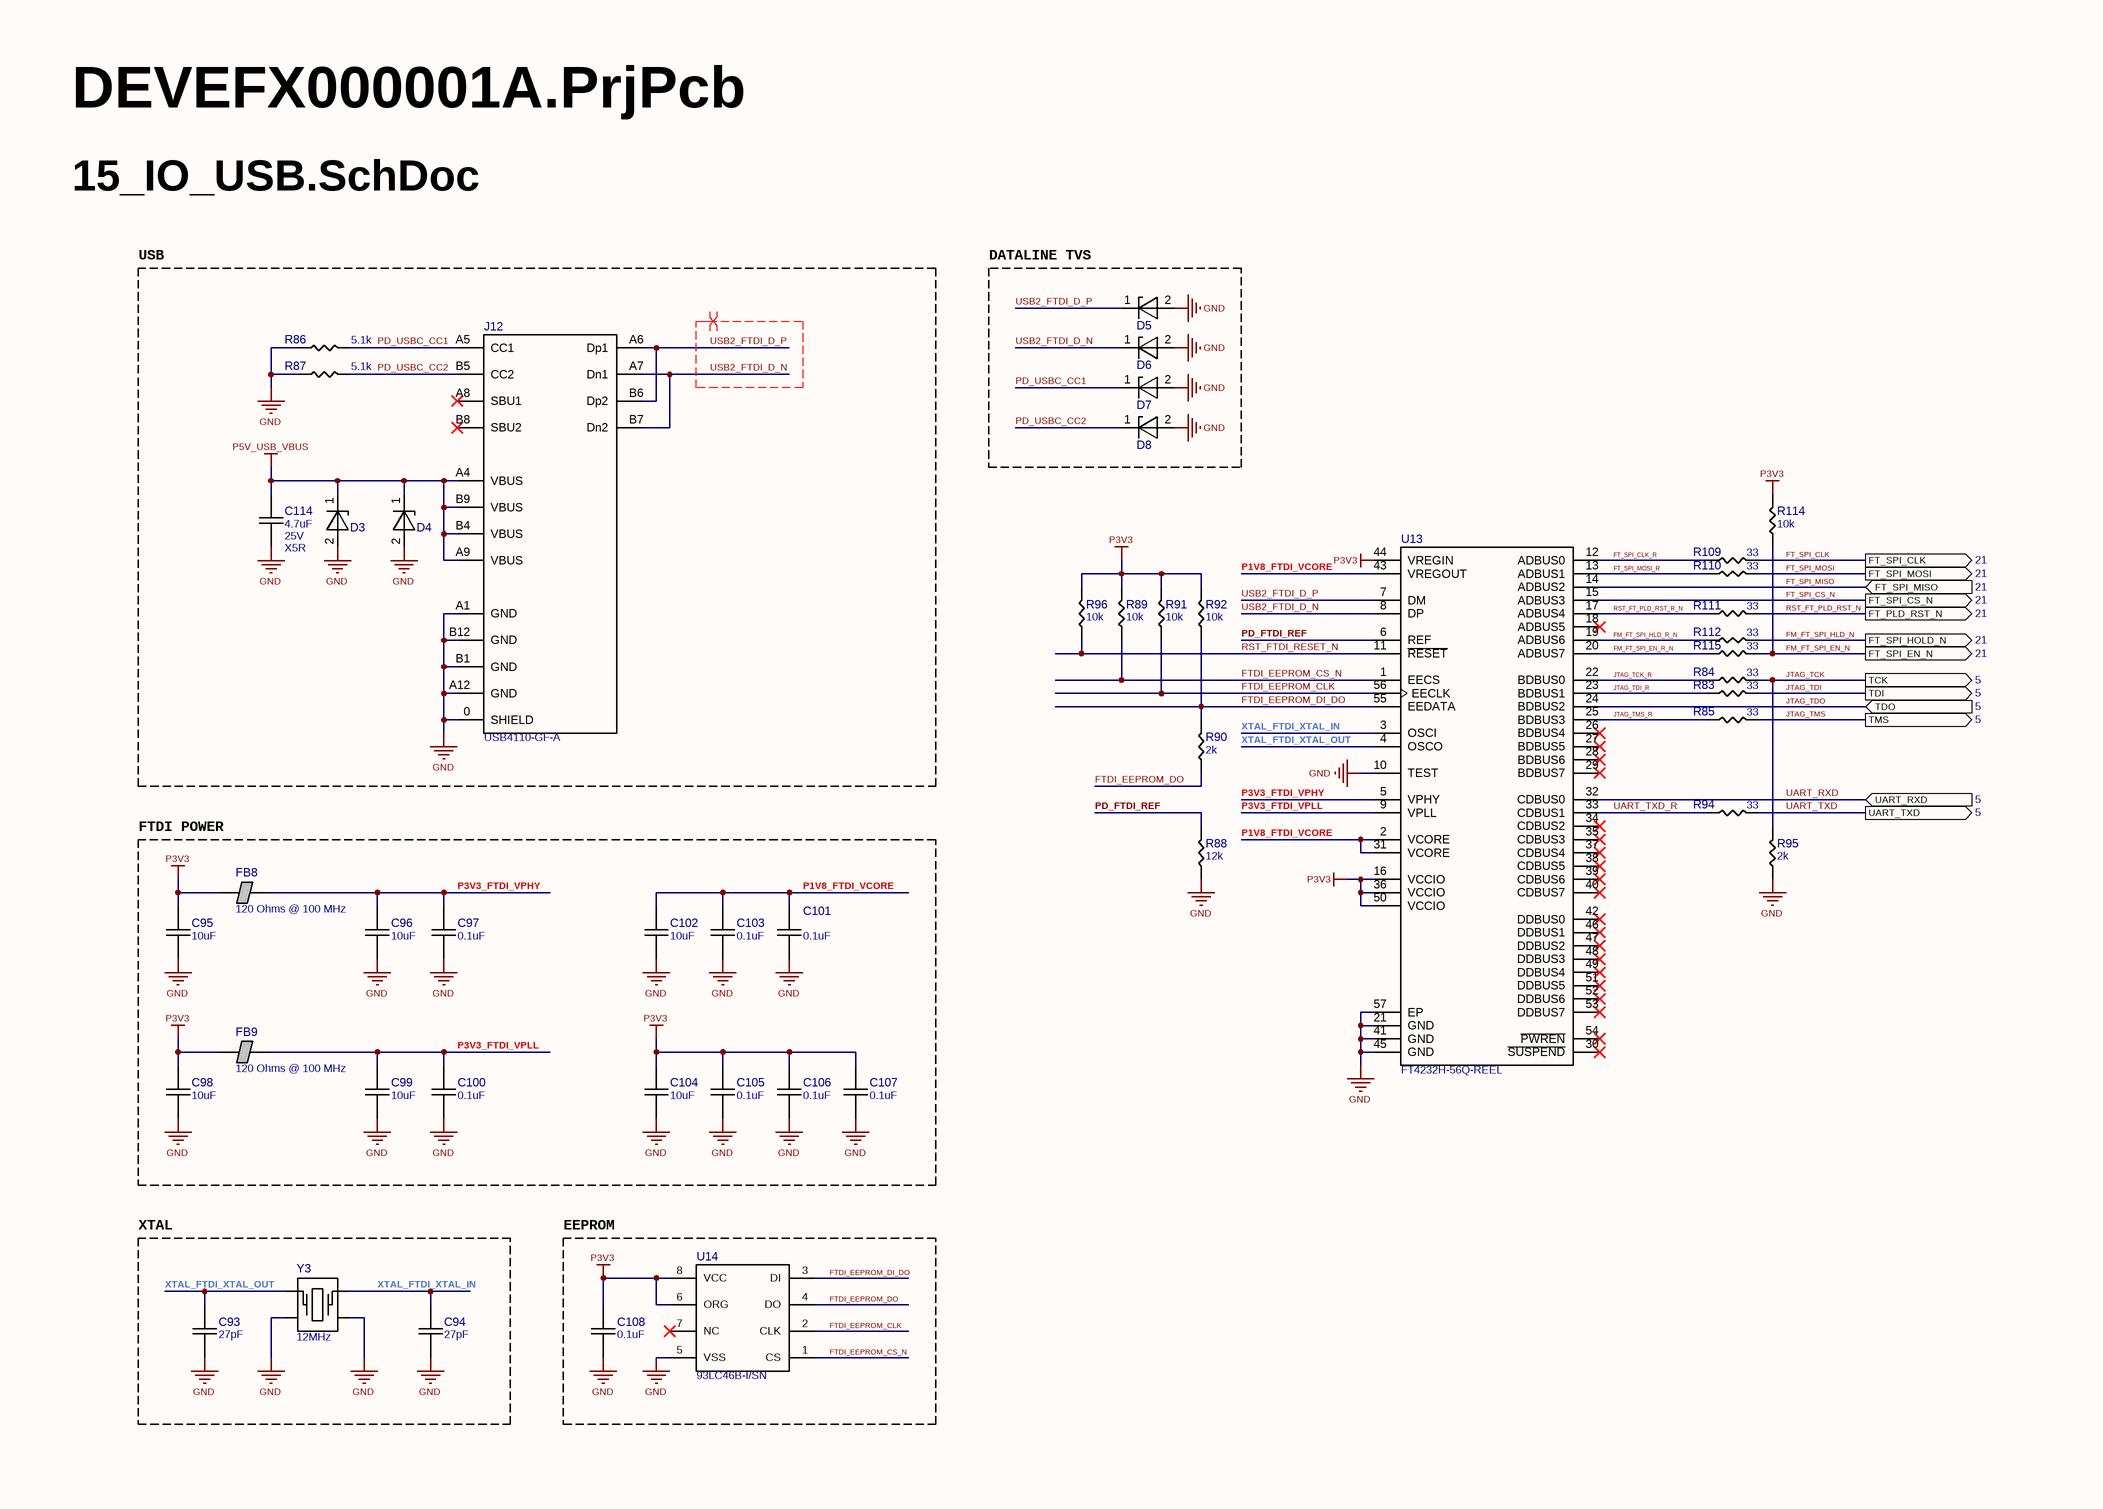
[diagram p14: 15_IO_USB.SchDoc]

### Parts
C93  27pF  [CAPC1005X06N]
C94  27pF  [CAPC1005X06N]
C95  10uF  [CAPC1005X06N]
C96  10uF  [CAPC1005X06N]
C97  0.1uF  [CAPC1005X06N]
C98  10uF  [CAPC1005X06N]
C99  10uF  [CAPC1005X06N]
C100  0.1uF  [CAPC1005X06N]
C101  0.1uF  [CAPC1005X06N]
C102  10uF  [CAPC1005X06N]
C103  0.1uF  [CAPC1005X06N]
C104  10uF  [CAPC1005X06N]
C105  0.1uF  [CAPC1005X06N]
C106  0.1uF  [CAPC1005X06N]
C107  0.1uF  [CAPC1005X06N]
C108  0.1uF  [CAPC1005X06N]
C114  4.7uF  Voltage: 25V  TempC: X5R  [CAPC1608X08N]
D3  ESD401DPYR  [DFN65P100X50-2N]  (value not drawn)
D4  ESD401DPYR  [DFN65P100X50-2N]  (value not drawn)
D5  ESD401DPYR  [DFN65P100X50-2N]  (value not drawn)
D6  ESD401DPYR  [DFN65P100X50-2N]  (value not drawn)
D7  ESD401DPYR  [DFN65P100X50-2N]  (value not drawn)
D8  ESD401DPYR  [DFN65P100X50-2N]  (value not drawn)
FB8  120 Ohms @ 100 MHz  [INDC1005X05N]
FB9  120 Ohms @ 100 MHz  [INDC1005X05N]
J12  USB4110-GF-A  [GCT_USB4110-GF-A]
R83  33  [RESC1005X03N]
R84  33  [RESC1005X03N]
R85  33  [RESC1005X03N]
R86  5.1k  [RESC1005X03N]
R87  5.1k  [RESC1005X03N]
R88  12k  [RESC1005X03N]
R89  10k  [RESC1005X03N]
R90  2k  [RESC1005X03N]
R91  10k  [RESC1005X03N]
R92  10k  [RESC1005X03N]
R94  33  [RESC1005X03N]
R95  2k  [RESC1005X03N]
R96  10k  [RESC1005X03N]
R109  33  [RESC1005X03N]
R110  33  [RESC1005X03N]
R111  33  [RESC1005X03N]
R112  33  [RESC1005X03N]
R114  10k  [RESC1005X03N]
R115  33  [RESC1005X03N]
U13  FT4232H-56Q-REEL  [QFN50P800X800X90_HS-57N]
U14  93LC46B-I/SN  [SOIC127P590X175-8N]
Y3  12MHz  [XTAL_3225]

### Blocks framed on the sheet
USB: C114 D3 D4 J12 R86 R87
DATALINE TVS: D5-D8
FTDI POWER: C95-C107 FB8 FB9
XTAL: C93 C94 Y3
EEPROM: C108 U14

### Ports
FT_PLD_RST_N (out, see 21), FT_SPI_CLK (out, see 21), FT_SPI_CS_N (out, see 21), FT_SPI_EN_N (out, see 21), FT_SPI_HOLD_N (out, see 21), FT_SPI_MISO (in, see 21), FT_SPI_MOSI (out, see 21), TCK (out, see 5), TDI (out, see 5), TDO (in, see 5), TMS (out, see 5), UART_RXD (in, see 5), UART_TXD (out, see 5)

### Nets
GND: C93.1 C94.1 C95.1 C96.1 C97.1 C98.1 C99.1 C100.1 C101.1 C102.1 C103.1 C104.1 C105.1 C106.1 C107.1 C108.1 C114.1 D3.2(A) D4.2(A) D5.2(A) D6.2(A) D7.2(A) D8.2(A) J12.0(SHIELD) J12.A1(GND) J12.A12(GND) J12.B1(GND) J12.B12(GND) R86.1 R87.1 R88.1 R95.1 U13.10(TEST) U13.21(GND) U13.41(GND) U13.45(GND) U13.57(EP) U14.5(VSS) Y3.2 Y3.4
P3V3: C95.2 C98.2 C104.2 C105.2 C106.2 C107.2 C108.2 FB8.1 FB9.1 R89.2 R91.2 R92.2 R96.2 R114.2 U13.16(VCCIO) U13.36(VCCIO) U13.44(VREGIN) U13.50(VCCIO) U14.6(ORG) U14.8(VCC)
P5V_USB_VBUS: C114.2 D3.1(C) D4.1(C) J12.A4(VBUS) J12.A9(VBUS) J12.B4(VBUS) J12.B9(VBUS)
FM_FT_SPI_EN_N: R114.1 R115.2 ; port FT_SPI_EN_N
FM_FT_SPI_EN_R_N: R115.1 U13.20(ADBUS7)
FM_FT_SPI_HLD_N: R112.2 ; port FT_SPI_HOLD_N
FM_FT_SPI_HLD_R_N: R112.1 U13.19(ADBUS6)
FT_SPI_CLK: R109.2 ; port FT_SPI_CLK
FT_SPI_CLK_R: R109.1 U13.12(ADBUS0)
FT_SPI_CS_N: U13.15(ADBUS3) ; port FT_SPI_CS_N
FT_SPI_MISO: U13.14(ADBUS2) ; port FT_SPI_MISO
FT_SPI_MOSI: R110.2 ; port FT_SPI_MOSI
FT_SPI_MOSI_R: R110.1 U13.13(ADBUS1)
FTDI_EEPROM_CLK: R91.1 U13.56(EECLK) U14.2(CLK)
FTDI_EEPROM_CS_N: R89.1 U13.1(EECS) U14.1(CS)
FTDI_EEPROM_DI_DO: R90.2 R92.1 U13.55(EEDATA) U14.3(DI)
FTDI_EEPROM_DO: R90.1 U14.4(DO)
JTAG_TCK: R84.2 R95.2 ; port TCK
JTAG_TCK_R: R84.1 U13.22(BDBUS0)
JTAG_TDI: R83.2 ; port TDI
JTAG_TDI_R: R83.1 U13.23(BDBUS1)
JTAG_TDO: U13.24(BDBUS2) ; port TDO
JTAG_TMS: R85.2 ; port TMS
JTAG_TMS_R: R85.1 U13.25(BDBUS3)
P1V8_FTDI_VCORE: C101.2 C102.2 C103.2 U13.2(VCORE) U13.31(VCORE) U13.43(VREGOUT)
P3V3_FTDI_VPHY: C96.2 C97.2 FB8.2 U13.5(VPHY)
P3V3_FTDI_VPLL: C99.2 C100.2 FB9.2 U13.9(VPLL)
PD_FTDI_REF: R88.2 U13.6(REF)
PD_USBC_CC1: D7.1(C) J12.A5(CC1) R86.2
PD_USBC_CC2: D8.1(C) J12.B5(CC2) R87.2
RST_FT_PLD_RST_N: R111.2 ; port FT_PLD_RST_N
RST_FT_PLD_RST_R_N: R111.1 U13.17(ADBUS4)
RST_FTDI_RESET_N: R96.1 U13.11(~{RESET})
UART_RXD: U13.32(CDBUS0) ; port UART_RXD
UART_TXD: R94.2 ; port UART_TXD
UART_TXD_R: R94.1 U13.33(CDBUS1)
USB2_FTDI_D_N: D6.1(C) J12.A7(Dn1) J12.B7(Dn2) U13.8(DP)
USB2_FTDI_D_P: D5.1(C) J12.A6(Dp1) J12.B6(Dp2) U13.7(DM)
XTAL_FTDI_XTAL_IN: C94.2 U13.3(OSCI) Y3.3
XTAL_FTDI_XTAL_OUT: C93.2 U13.4(OSCO) Y3.1

Not connected (* = marked no-connect by the designer): J12 A8(SBU1)* B8(SBU2)*; U13 18(ADBUS5)* 26(BDBUS4)* 27(BDBUS5)* 28(BDBUS6)* 29(BDBUS7)* 30(~{SUSPEND})* 34(CDBUS2)* 35(CDBUS3)* 37(CDBUS4)* 38(CDBUS5)* 39(CDBUS6)* 40(CDBUS7)* 42(DDBUS0)* 46(DDBUS1)* 47(DDBUS2)* 48(DDBUS3)* 49(DDBUS4)* 51(DDBUS5)* 52(DDBUS6)* 53(DDBUS7)* 54(~{PWREN})*; U14 7(NC)*

### Layout directives
differential pair; differential pair class 90D: USB2_FTDI_D_N, USB2_FTDI_D_P

### Library data of the parts
C93 C94 = CC0402JRNPO9BN270: as C41 on sheet 13_IO_ETH; Part Number: CC0402JRNPO9BN270; Value: 27pF; Voltage: 50V; Manufacturer Part Number 1: CC0402JRNPO9BN270; Supplier 1: Digi-Key; Supplier Part Number 1: 311-1019-1-ND
C95 C96 C98 C99 C102 C104 = GRM155R60J106ME47D: as C1 on sheet 10_FPGA_PWR; Part Number: GRM155R60J106ME47D; Value: 10uF; Voltage: 6.3V; TempC: X5R; Manufacturer Part Number 1: GRM155R60J106ME47D; Supplier 1: Digi-Key; Supplier Part Number 1: 490-13239-1-ND
C97 C100 C101 C103 C105-C108 = GRM155R71E104KE14J: as C25 on sheet 13_IO_ETH; Part Number: GRM155R71E104KE14J; Value: 0.1uF; Voltage: 25V; TempC: X7R; Manufacturer Part Number 1: GRM155R71E104KE14J; Supplier 1: Digi-Key; Supplier Part Number 1: 490-14603-1-ND
C114 = GRM188R61E475KE11D: CAP CER 4.7UF 25V X5R 0603; Manufacturer 1: Murata Electronics; Tol: 10%; Part Number: GRM188R61E475KE11D; Value: 4.7uF; Manufacturer Part Number 1: GRM188R61E475KE11D; Supplier 1: Digi-Key; Supplier Part Number 1: 490-7203-1-ND
D3-D8 = ESD401DPYR: TVS DIODE 5.5V 24V 2X1SON; Manufacturer 1: Texas Instruments; Part Number: ESD401DPYR; Manufacturer Part Number 1: ESD401DPYR; Supplier 1: Digi-Key; Supplier Part Number 1: 296-47160-1-ND
FB8 FB9 = BLM15PD121SN1D: as FB3 on sheet 10_FPGA_PWR; Part Number: BLM15PD121SN1D; Value: 120 Ohms @ 100 MHz; Manufacturer Part Number 1: BLM15PD121SN1D; Supplier 1: Digi-Key; Supplier Part Number 1: 490-5203-1-ND
J12 = USB4110-GF-A: CONN RCP USB2.0 TYP C 24P SMD RA; Manufacturer 1: GCT; Part Number: USB4110-GF-A; Manufacturer Part Number 1: USB4110-GF-A; Supplier 1: Digi-Key; Supplier Part Number 1: 2073-USB4110-GF-A-1-ND
R83-R85 R94 R109-R112 R115 = RC0402FR-0733RL: as R62 on sheet 05_FPGA_HVIO; Part Number: RC0402FR-0733RL; Value: 33; Tol: 1%; Manufacturer Part Number 1: RC0402FR-0733RL; Supplier 1: Digi-Key; Supplier Part Number 1: 311-33.0LRCT-ND
R86 R87 = RC0402FR-075K1L: RES SMD 5.1K OHM 1% 1/16W 0402; Manufacturer 1: Yageo; Part Number: RC0402FR-075K1L; Value: 5.1k; Tol: 1%; Manufacturer Part Number 1: RC0402FR-075K1L; Supplier 1: Digi-Key; Supplier Part Number 1: 311-5.10KLRCT-ND
R88 = RC0402FR-0712KL: RES SMD 12K OHM 1% 1/16W 0402; Manufacturer 1: Yageo; Part Number: RC0402FR-0712KL; Value: 12k; Tol: 1%; Manufacturer Part Number 1: RC0402FR-0712KL; Supplier 1: Digi-Key; Supplier Part Number 1: 311-12.0KLRCT-ND
R89 R91 R92 R96 R114 = RC0402FR-0710KL: RES SMD 10K OHM 1% 1/16W 0402; Manufacturer 1: Yageo; Part Number: RC0402FR-0710KL; Value: 10k; Tol: 1%; Manufacturer Part Number 1: RC0402FR-0710KL; Supplier 1: Digi-Key; Supplier Part Number 1: 311-10.0KLRCT-ND
R90 R95 = RC0402FR-072KL: RES SMD 2K OHM 1% 1/16W 0402; Manufacturer 1: Yageo; Part Number: RC0402FR-072KL; Value: 2k; Tol: 1%; Manufacturer Part Number 1: RC0402FR-072KL; Supplier 1: Digi-Key; Supplier Part Number 1: 311-2KLRCT-ND
U13 = FT4232H-56Q-REEL: IC USB TO UART/MPSSE QUAD 56VQFN; Manufacturer 1: FTDI, Future Technology Devices International Ltd; Part Number: FT4232H-56Q-REEL; Manufacturer Part Number 1: FT4232H-56Q-REEL; Supplier 1: Digi-Key; Supplier Part Number 1: 768-1378-1-ND
U14 = 93LC46B-I/SN: IC EEPROM 1KBIT SPI 2MHZ 8SOIC; Manufacturer 1: Microchip Technology; Part Number: 93LC46B-I/SN; Manufacturer Part Number 1: 93LC46B-I/SN; Supplier 1: Digi-Key; Supplier Part Number 1: 93LC46B-I/SN-ND
Y3 = 7V-12.000MDDJ-T: CRYSTAL 12.0000MHZ 18PF SMD; Manufacturer 1: TXC CORPORATION; Part Number: 7V-12.000MDDJ-T; Value: 12MHz; Manufacturer Part Number 1: 7V-12.000MDDJ-T; Supplier 1: Digi-Key; Supplier Part Number 1: 887-7V-12.000MDDJ-TCT-ND

## Sheet 16_IO_LVDS.SchDoc
size A3; DocumentNumber: 16; SheetNumber: 16; SheetTotal: 21
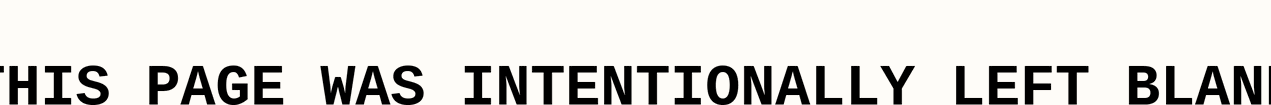
[diagram p15: 16_IO_LVDS.SchDoc]

### Notes on the sheet
- THIS PAGE WAS INTENTIONALLY LEFT BLANK

## Sheet 17_IO_HEADERS.SchDoc
size A3; DocumentNumber: 17; SheetNumber: 17; SheetTotal: 21
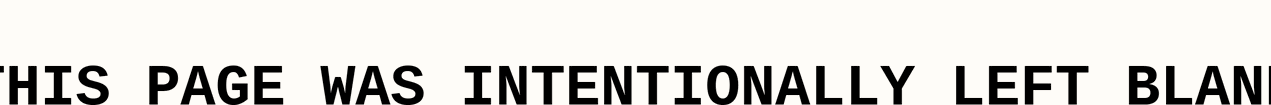
[diagram p16: 17_IO_HEADERS.SchDoc]

### Notes on the sheet
- THIS PAGE WAS INTENTIONALLY LEFT BLANK